# EAGLE board eightbyeight (EAGLE 7.7.0)
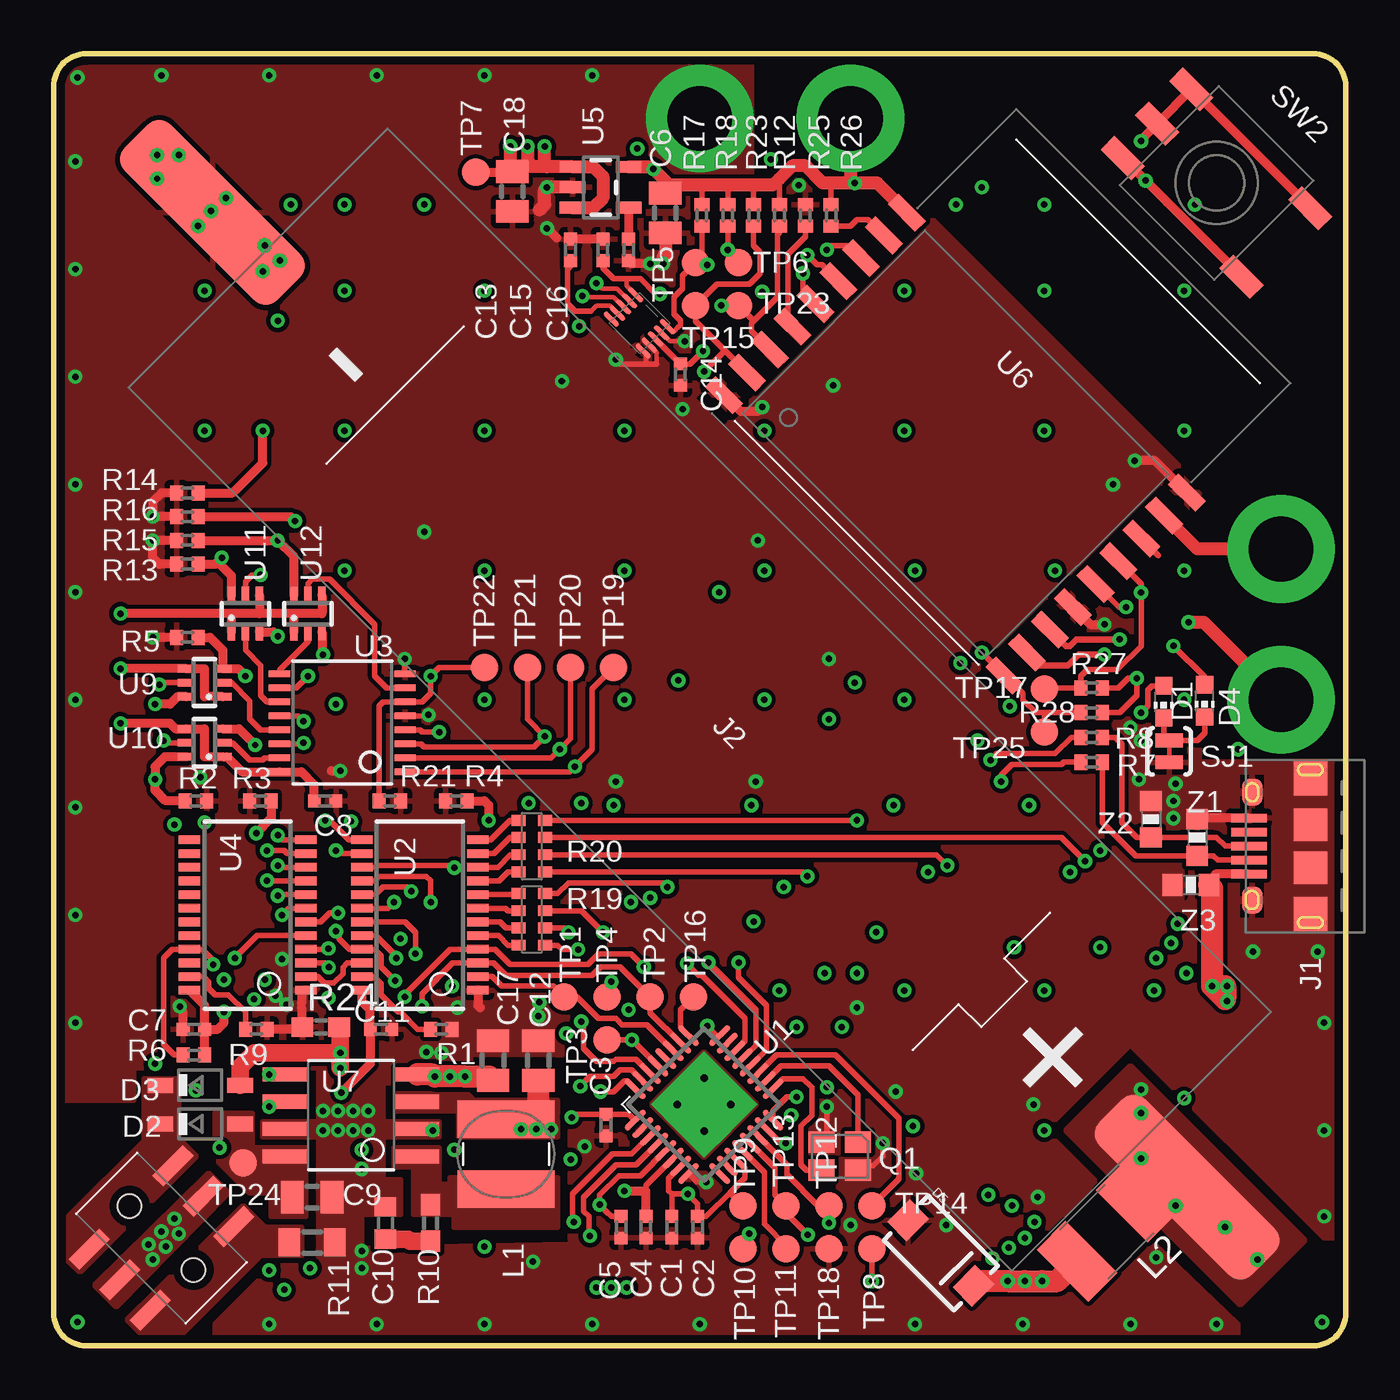
[diagram p6: board, top side]
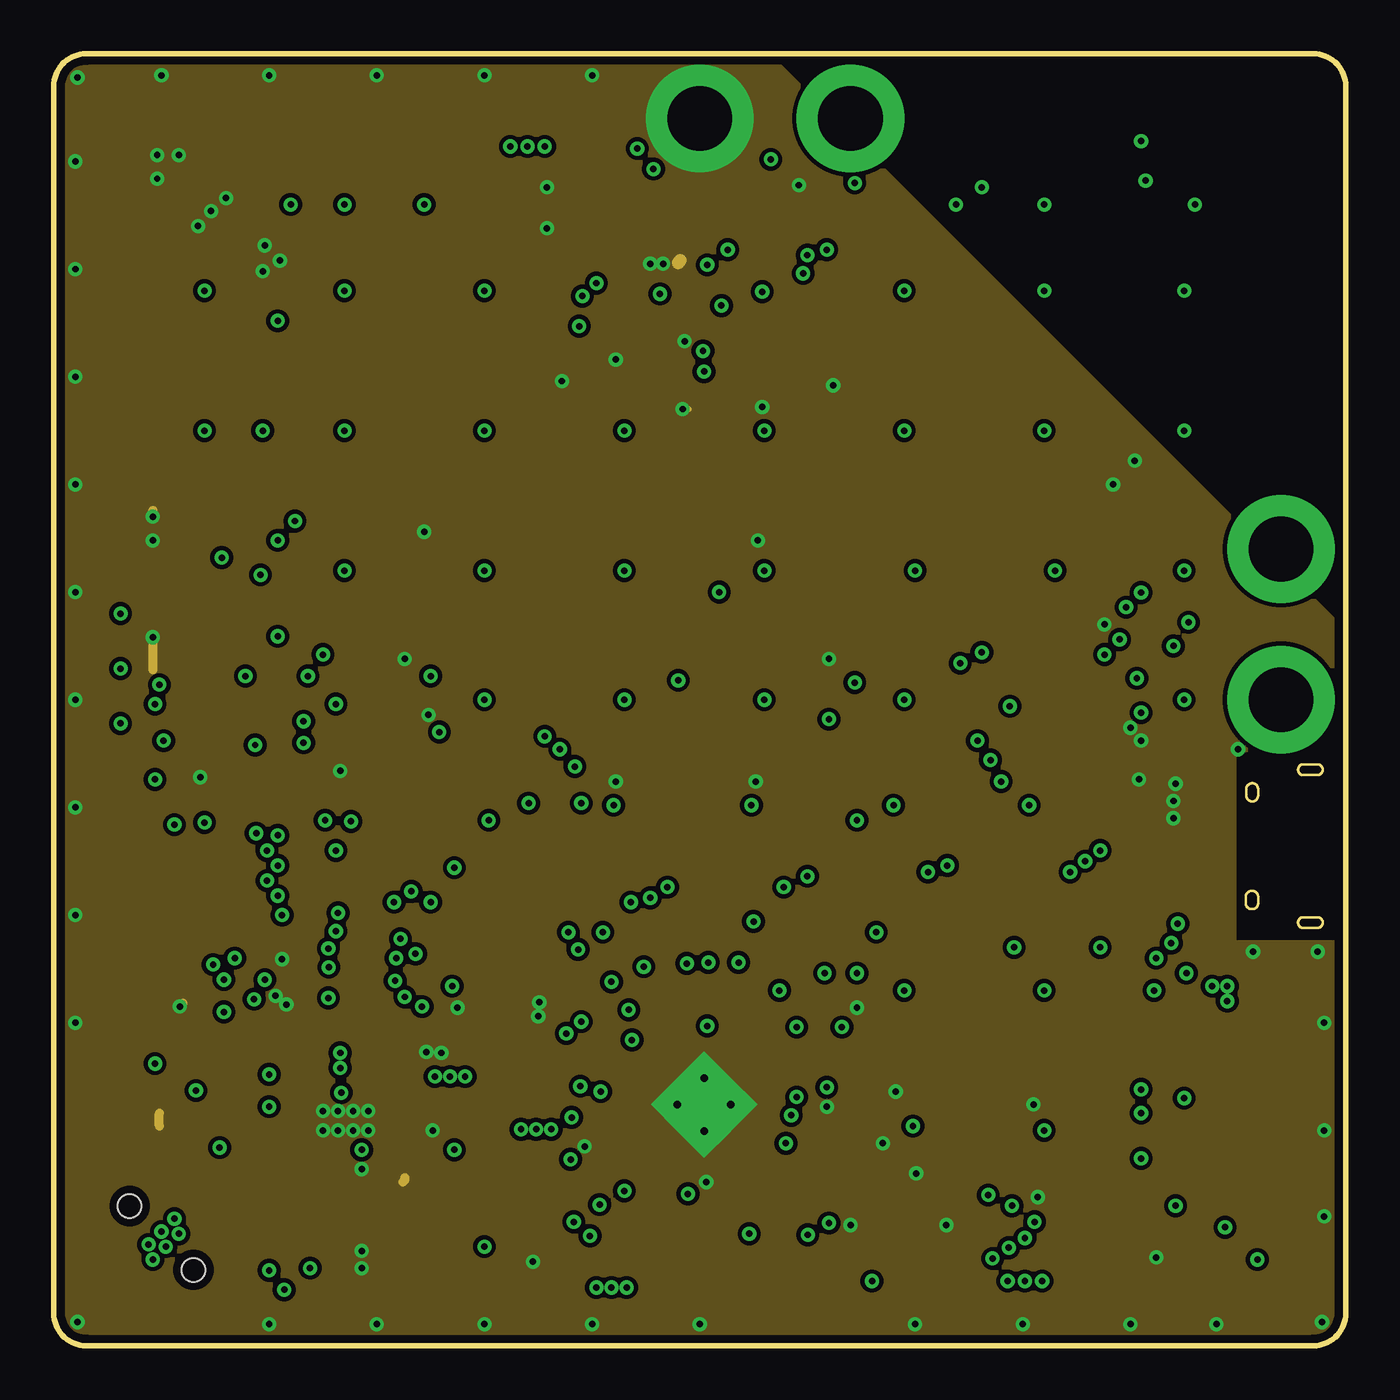
[diagram p7: board, inner layer GND]
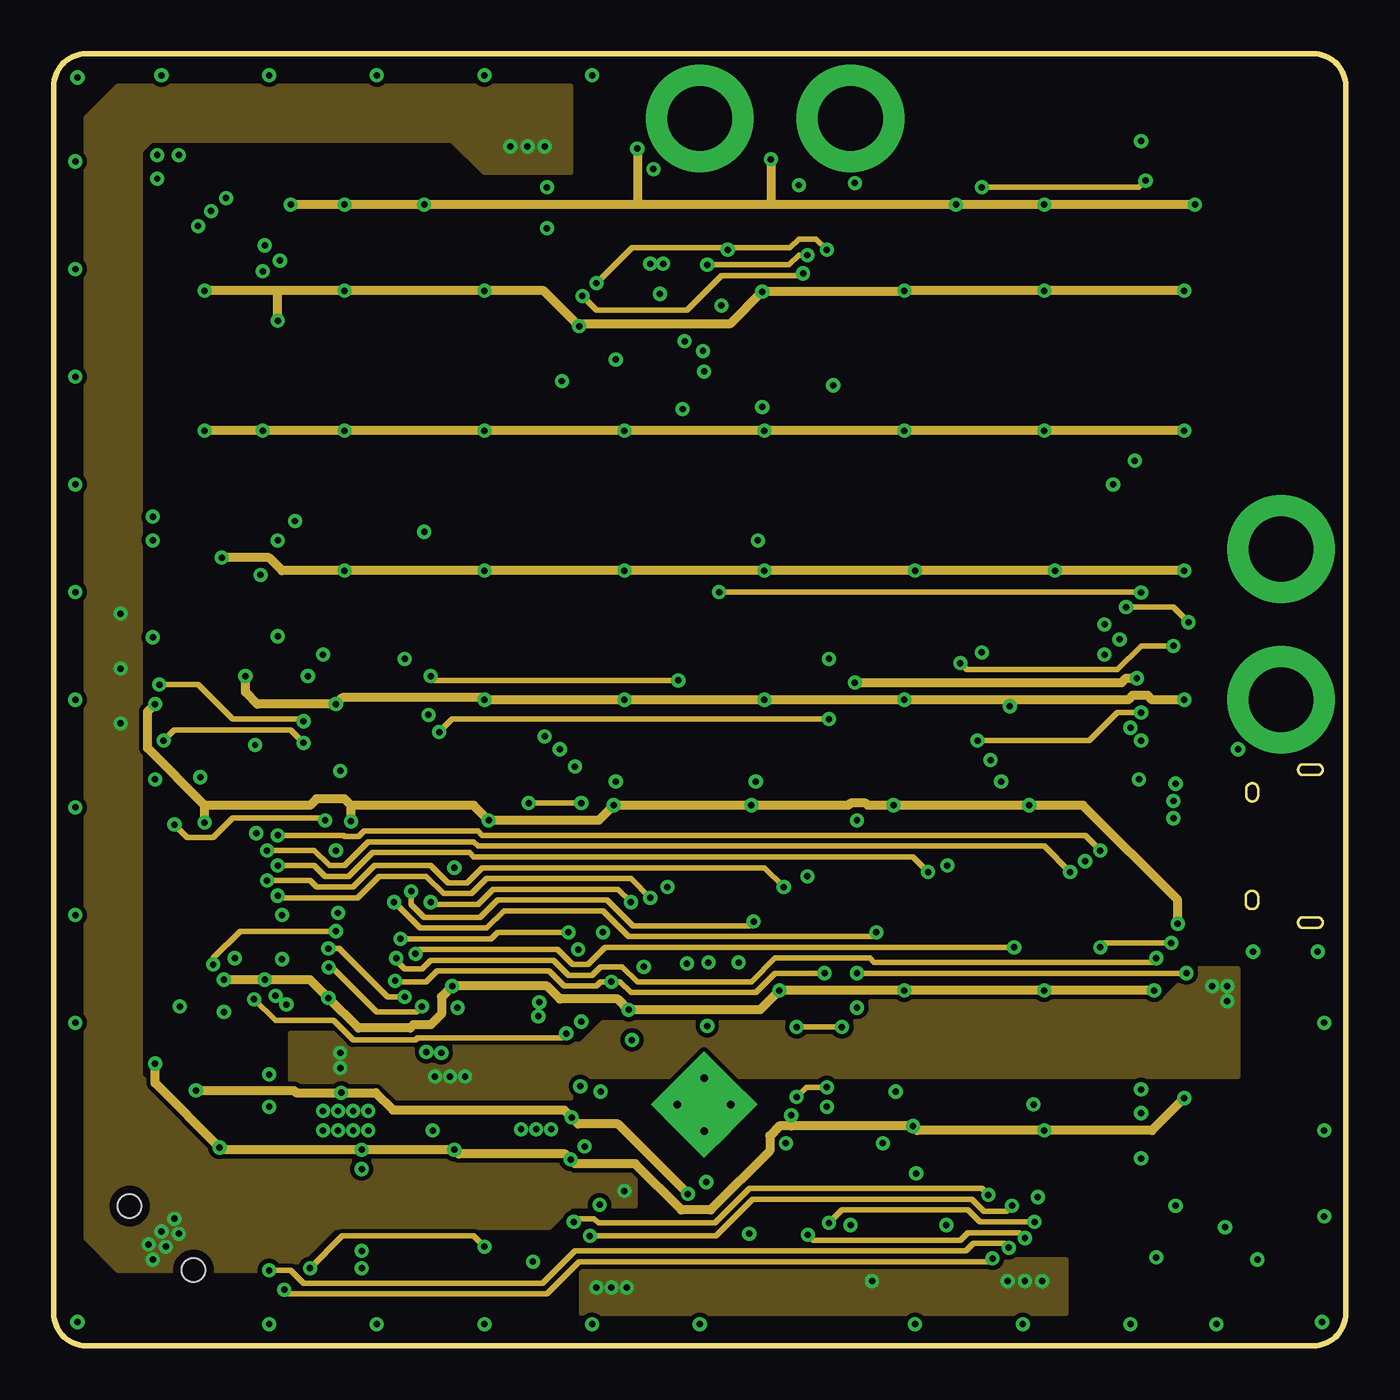
[diagram p8: board, inner layer Route]
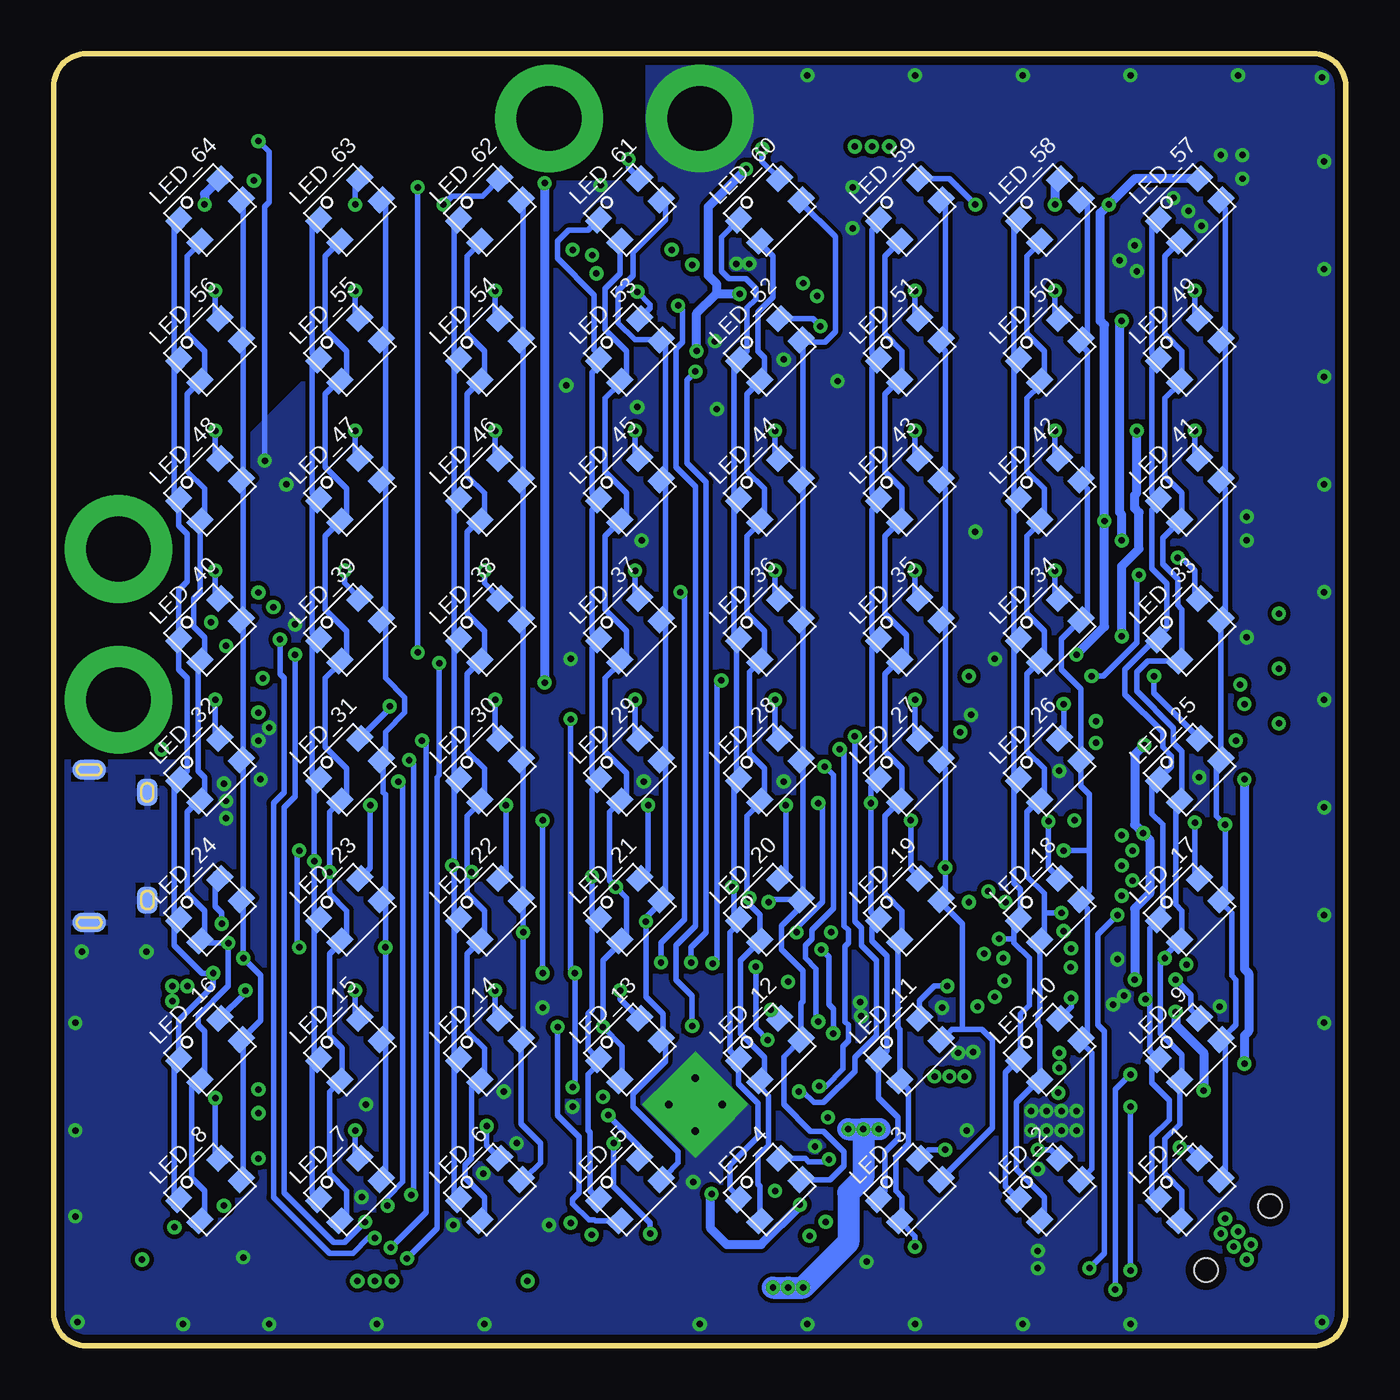
[diagram p9: board, bottom side, seen from below]

Size 60 x 60 mm. Coordinates in mm from the lower left corner, seen from the top.
Outline: 0,58.5 0,1.5 arc90 1.5,0 58.5,0 arc90 60,1.5 60,58.5 arc90 58.5,60 1.5,60 arc90 0,58.5
Copper layers (1*2+15*16): Top 0.0356mm / dielectric 0.6mm / GND 0.0356mm / dielectric 0.2mm / Route 0.0356mm / dielectric 0.6mm / Bottom 0.0356mm
Design rules "BlinkyTape *": minimum track width 0.25mm, minimum drill 0.3mm, track to track 0.2mm, track to pad 0.2mm, pad to pad 0.2mm, via to via 0.2mm, smd to smd 0.2mm, copper to edge 15mil, drill to drill 0.25mm, minimum pad ring 7mil, minimum via ring 7mil, stop-mask expansion 2mil, vias tented up to drill 0.35mm, thermal gap 10mil
Net classes: 1 power: width 0.254 mm, drill 0.35 mm
tRestrict: area 55.1,25.9 to 55.5,26.5; area 55.8,25.9 to 56.2,26.5; area 55.8,24.9 to 56.2,25.5; area 55.1,24.9 to 55.5,25.5; area 55.1,20.9 to 55.5,21.5; area 55.8,20.9 to 56.2,21.5; area 55.8,19.9 to 56.2,20.5; area 55.1,19.9 to 55.5,20.5; area 47.2,3.6 to 50.6,7; area 19.5,13.1 to 23.3,13.4; 13 lines
bRestrict: area 55.8,25.9 to 56.2,26.5; area 55.1,25.9 to 55.5,26.5; area 55.1,24.9 to 55.5,25.5; area 55.8,24.9 to 56.2,25.5; area 55.8,20.9 to 56.2,21.5; area 55.1,20.9 to 55.5,21.5; area 55.1,19.9 to 55.5,20.5; area 55.8,19.9 to 56.2,20.5; area 57.5,19.8 to 58.1,20.2; area 58.6,19.8 to 59.2,20.2; area 58.6,19.1 to 59.2,19.5; area 57.5,19.1 to 58.1,19.5; 4 more areas

## Footprints (pad centres in the part's own frame; a part is rotated, then mirrored left to right if it is on the bottom)
CAP_0402 = smd 0.6 x 0.6: 1 -0.5,0; 2 0.5,0
CAP_0805 = smd 1.05 x 1.5: 1 -0.925,0; 2 0.925,0
CAP_0603 = smd 0.9 x 1: 1 -0.75,0; 2 0.75,0
CHIP-LED0603 = smd 0.8 x 0.8: A 0,-0.75; C 0,0.75
SOD-123 = smd 1.2 x 0.7: A 1.85,0; C -1.85,0
SMA-DIODE = smd 1.27 x 1.47: A -2.15,0; C 2.15,0
USB_MICRO_THRUHOLE = smd 1.645 x 1.55: PAD$1 -3.172,0; PAD$4 3.172,0 | smd 1.5 x 1.55: PAD$2 -1,0; PAD$3 1,0 | smd 1.25 x 0.95: PAD$5 -2.5,2.7; PAD$6 2.5,2.7 | smd 0.9 x 1.55 bottom: PAD$7 -3.55,0; PAD$8 3.55,0 | smd 1.25 x 0.95 bottom: PAD$9 -2.5,2.7; PAD$10 2.5,2.7 | smd 0.4 x 1.65: PIN$1 -1.3,2.85; PIN$2 -0.65,2.85; PIN$3 0,2.85; PIN$4 0.65,2.85; PIN$5 1.3,2.85
BATTERY_AA_SMD = smd 10 x 3: + 32,0; - -32,0
INDUCTOR_CD43 = smd 1.75 x 4.5: P$1 -1.625,0; P$2 1.625,0
L1812 = smd 1.9 x 3.4: 1 -1.95,0; 2 1.95,0
LED_3528 = smd 1 x 0.8: 1 -1.35,0.7; 2 1.35,0.7; 3 1.36,-0.7; 4 -1.35,-0.7
CRSYTAL_2520 = smd 1.2 x 1: P$1 -0.85,-0.65; P$2 0.85,-0.65; P$3 0.85,0.65; P$4 -0.85,0.65
R_0402 = smd 0.6 x 0.7: 1 -0.5,0; 2 0.5,0
R_0603 = smd 1 x 0.9: 1 -0.85,0; 2 0.85,0
R_0805 = smd 1 x 1.3: 1 -1.05,0; 2 1.05,0
0603-ARV = smd 0.5 x 0.65: 1 -1.2,-0.625; 2 -0.4,-0.625; 3 0.4,-0.625; 4 1.2,-0.625; 5 1.2,0.625; 6 0.4,0.625; 7 -0.4,0.625; 8 -1.2,0.625
SJ_2S-TRACE = smd 0.635 x 1.27: 1 -0.508,0; 2 0.508,0
SWITCH_6P-2POS = smd 0.7 x 2: O0 -2,2.75; O1 -2,-2.75; P0 0,2.75; P1 0,-2.75; S0 2,2.75; S1 2,-2.75 | hole 1.1: -2.1,0; 2.1,0
TD-07XB = smd 2 x 0.9: 1 -3.9,-2.25; 2 3.9,-2.25; 3 -3.9,2.25; 4 3.9,2.25; 5 -3.9,0
B1,27 = smd 1.27 x 1.27: TP 0,0
QFN32_5X5_LONGLEADS = smd 1.25 x 0.275: 1 -2.775,1.75; 2 -2.775,1.25; 3 -2.775,0.75; 4 -2.775,0.25; 5 -2.775,-0.25; 6 -2.775,-0.75; 7 -2.775,-1.25; 8 -2.775,-1.75; 17 2.775,-1.75; 18 2.775,-1.25; 19 2.775,-0.75; 20 2.775,-0.25; 21 2.775,0.25; 22 2.775,0.75; 23 2.775,1.25; 24 2.775,1.75 | smd 0.275 x 1.25: 9 -1.75,-2.775; 10 -1.25,-2.775; 11 -0.75,-2.775; 12 -0.25,-2.775; 13 0.25,-2.775; 14 0.75,-2.775; 15 1.25,-2.775; 16 1.75,-2.775; 25 1.75,2.775; 26 1.25,2.775; 27 0.75,2.775; 28 0.25,2.775; 29 -0.25,2.775; 30 -0.75,2.775; 31 -1.25,2.775; 32 -1.75,2.775 | drill 0.35 pad 1.75 square: PAD@1 -0.875,0.875; PAD@4 0.875,0.875; PAD@11 0.875,-0.875 | drill 0.35 pad 1.76 square: PAD@9 -0.875,-0.875
SSOP24-150 = smd 1 x 0.4: 1 -2.7,3.493; 2 -2.7,2.857; 3 -2.7,2.223; 4 -2.7,1.587; 5 -2.7,0.953; 6 -2.7,0.318; 7 -2.7,-0.318; 8 -2.7,-0.953; 9 -2.7,-1.587; 10 -2.7,-2.223; 11 -2.7,-2.857; 12 -2.7,-3.493; 13 2.7,-3.493; 14 2.7,-2.857; 15 2.7,-2.223; 16 2.7,-1.587; 17 2.7,-0.953; 18 2.7,-0.318; 19 2.7,0.318; 20 2.7,0.953; 21 2.7,1.587; 22 2.7,2.223; 23 2.7,2.857; 24 2.7,3.493
TSSOP16 = smd 0.305 x 0.991: 1 -1.95,-2.918; 2 -1.3,-2.918; 3 -0.65,-2.918; 4 0,-2.918; 5 0.65,-2.918; 6 1.3,-2.918; 7 1.95,-2.918; 8 2.6,-2.918; 9 2.6,2.918; 10 1.95,2.918; 11 1.3,2.918; 12 0.65,2.918; 13 0,2.918; 14 -0.65,2.918; 15 -1.3,2.918; 16 -1.95,2.918
SOT23-5 = smd 0.55 x 1.2: 1 -0.95,-1.3; 2 0,-1.3; 3 0.95,-1.3; 4 0.95,1.3; 5 -0.95,1.3
ESP_WROOM_02 = smd 1.8 x 0.7: 3V3 -9.2,3; EN -9.2,1.5; GND$1 -9.2,-9; GND$2 9.2,3; GND$3 9.2,-4.5; IO0 -9.2,-7.5; IO2 -9.2,-6; IO4 9.2,-9; IO5 9.2,-3; IO12 -9.2,-1.5; IO13 -9.2,-3; IO14 -9.2,0; IO15 -9.2,-4.5; IO18 9.2,1.5; RST 9.2,-1.5; RXD 9.2,-7.5; TOUT 9.2,0; TXD 9.2,-6
SO08-150 = smd 0.66 x 2.032: 1 -1.905,-3.073; 2 -0.635,-3.073; 3 0.635,-3.073; 4 1.905,-3.073; 5 1.905,3.073; 6 0.635,3.073; 7 -0.635,3.073; 8 -1.905,3.073
VFDFN-10 = smd 0.9 x 0.225: P$1 -1.05,0.8; P$2 -1.05,0.4; P$3 -1.05,0; P$4 -1.05,-0.4; P$5 -1.05,-0.8; P$6 1.05,-0.8; P$7 1.05,-0.4; P$8 1.05,0; P$9 1.05,0.4; P$10 1.05,0.8
SC70-6L = smd 0.35 x 0.8: 1 -0.65,-0.85; 2 0,-0.85; 3 0.65,-0.85; 4 0.65,0.85; 5 0,0.85; 6 -0.65,0.85
IO_HOLE_3MM = drill 3 pad 5: 1 0,0
SPARKFUN-RESISTORS_0603-RES = smd 0.94 x 1.016: 1 -0.85,0; 2 0.85,0

## Placement (x,y rotation side)
C1  100nF  [CAP_0402]  28.7,5.5 270 top
C2  100nF  [CAP_0402]  29.9,5.5 270 top
C3  100nF  [CAP_0402]  25.65,10.25 270 top
C4  100nF  [CAP_0402]  27.5,5.5 270 top
C5  2.2uF  [CAP_0402]  26.35,5.5 270 top
C6  10uF  [CAP_0805]  28.4,52.6 270 top
C7  100nF  [CAP_0402]  6.5,14.7 180 top
C8  100nF  [CAP_0402]  12.6,25.3 0 top
C9  10uF  [CAP_0805]  12,6.9 0 top
C10  2.2nF  [CAP_0603]  15.4,5.7 90 top
C11  100nF  [CAP_0402]  15.2,14.7 0 top
C12  10uF  [CAP_0805]  22.5,13.25 90 top
C13  100nF  [CAP_0402]  24,50.9 90 top
C14  100nF  [CAP_0402]  29.1,45.1 270 top
C15  100nF  [CAP_0402]  25.5,50.9 90 top
C16  47pF  [CAP_0402]  26.7,50.9 270 top
C17  10uF  [CAP_0805]  20.4,13.25 90 top
C18  10uF  [CAP_0805]  21.3,53.6 270 top
D1  ORANGE  [CHIP-LED0603]  51.55,29.9 180 top
D2  1N5819  [SOD-123]  6.8,10.3 0 top
D3  1N5819  [SOD-123]  6.8,12.1 0 top
D4  PURPLE  [CHIP-LED0603]  53.45,29.95 180 top
D5  1N5822  [SMA-DIODE]  41.2,4.3 315 top
J1  USB_MICROSMT+THRUHULE  [USB_MICRO_THRUHOLE]  58.36,23.2 90 top
J2  BATTERYAA_SMD  [BATTERY_AA_SMD]  30,30 315 top
L1  2.2uH  [INDUCTOR_CD43]  21,8.9 270 top
L2  1812L260THDR  [L1812]  48.9,5.3 225 top
LED_1  LED_RGB_CA3528  [LED_3528]  7.25,7.25 45 bottom
LED_2  LED_RGB_CA3528  [LED_3528]  13.75,7.25 45 bottom
LED_3  LED_RGB_CA3528  [LED_3528]  20.25,7.25 45 bottom
LED_4  LED_RGB_CA3528  [LED_3528]  26.75,7.25 45 bottom
LED_5  LED_RGB_CA3528  [LED_3528]  33.25,7.25 45 bottom
LED_6  LED_RGB_CA3528  [LED_3528]  39.75,7.25 45 bottom
LED_7  LED_RGB_CA3528  [LED_3528]  46.25,7.25 45 bottom
LED_8  LED_RGB_CA3528  [LED_3528]  52.75,7.25 45 bottom
LED_9  LED_RGB_CA3528  [LED_3528]  7.25,13.75 45 bottom
LED_10  LED_RGB_CA3528  [LED_3528]  13.75,13.75 45 bottom
LED_11  LED_RGB_CA3528  [LED_3528]  20.25,13.75 45 bottom
LED_12  LED_RGB_CA3528  [LED_3528]  26.75,13.75 45 bottom
LED_13  LED_RGB_CA3528  [LED_3528]  33.25,13.75 45 bottom
LED_14  LED_RGB_CA3528  [LED_3528]  39.75,13.75 45 bottom
LED_15  LED_RGB_CA3528  [LED_3528]  46.25,13.75 45 bottom
LED_16  LED_RGB_CA3528  [LED_3528]  52.75,13.75 45 bottom
LED_17  LED_RGB_CA3528  [LED_3528]  7.25,20.25 45 bottom
LED_18  LED_RGB_CA3528  [LED_3528]  13.75,20.25 45 bottom
LED_19  LED_RGB_CA3528  [LED_3528]  20.25,20.25 45 bottom
LED_20  LED_RGB_CA3528  [LED_3528]  26.75,20.25 45 bottom
LED_21  LED_RGB_CA3528  [LED_3528]  33.25,20.25 45 bottom
LED_22  LED_RGB_CA3528  [LED_3528]  39.75,20.25 45 bottom
LED_23  LED_RGB_CA3528  [LED_3528]  46.25,20.25 45 bottom
LED_24  LED_RGB_CA3528  [LED_3528]  52.75,20.25 45 bottom
LED_25  LED_RGB_CA3528  [LED_3528]  7.25,26.75 45 bottom
LED_26  LED_RGB_CA3528  [LED_3528]  13.75,26.75 45 bottom
LED_27  LED_RGB_CA3528  [LED_3528]  20.25,26.75 45 bottom
LED_28  LED_RGB_CA3528  [LED_3528]  26.75,26.75 45 bottom
LED_29  LED_RGB_CA3528  [LED_3528]  33.25,26.75 45 bottom
LED_30  LED_RGB_CA3528  [LED_3528]  39.75,26.75 45 bottom
LED_31  LED_RGB_CA3528  [LED_3528]  46.25,26.75 45 bottom
LED_32  LED_RGB_CA3528  [LED_3528]  52.75,26.75 45 bottom
LED_33  LED_RGB_CA3528  [LED_3528]  7.25,33.25 45 bottom
LED_34  LED_RGB_CA3528  [LED_3528]  13.75,33.25 45 bottom
LED_35  LED_RGB_CA3528  [LED_3528]  20.25,33.25 45 bottom
LED_36  LED_RGB_CA3528  [LED_3528]  26.75,33.25 45 bottom
LED_37  LED_RGB_CA3528  [LED_3528]  33.25,33.25 45 bottom
LED_38  LED_RGB_CA3528  [LED_3528]  39.75,33.25 45 bottom
LED_39  LED_RGB_CA3528  [LED_3528]  46.25,33.25 45 bottom
LED_40  LED_RGB_CA3528  [LED_3528]  52.75,33.25 45 bottom
LED_41  LED_RGB_CA3528  [LED_3528]  7.25,39.75 45 bottom
LED_42  LED_RGB_CA3528  [LED_3528]  13.75,39.75 45 bottom
LED_43  LED_RGB_CA3528  [LED_3528]  20.25,39.75 45 bottom
LED_44  LED_RGB_CA3528  [LED_3528]  26.75,39.75 45 bottom
LED_45  LED_RGB_CA3528  [LED_3528]  33.25,39.75 45 bottom
LED_46  LED_RGB_CA3528  [LED_3528]  39.75,39.75 45 bottom
LED_47  LED_RGB_CA3528  [LED_3528]  46.25,39.75 45 bottom
LED_48  LED_RGB_CA3528  [LED_3528]  52.75,39.75 45 bottom
LED_49  LED_RGB_CA3528  [LED_3528]  7.25,46.25 45 bottom
LED_50  LED_RGB_CA3528  [LED_3528]  13.75,46.25 45 bottom
LED_51  LED_RGB_CA3528  [LED_3528]  20.25,46.25 45 bottom
LED_52  LED_RGB_CA3528  [LED_3528]  26.75,46.25 45 bottom
LED_53  LED_RGB_CA3528  [LED_3528]  33.25,46.25 45 bottom
LED_54  LED_RGB_CA3528  [LED_3528]  39.75,46.25 45 bottom
LED_55  LED_RGB_CA3528  [LED_3528]  46.25,46.25 45 bottom
LED_56  LED_RGB_CA3528  [LED_3528]  52.75,46.25 45 bottom
LED_57  LED_RGB_CA3528  [LED_3528]  7.25,52.75 45 bottom
LED_58  LED_RGB_CA3528  [LED_3528]  13.75,52.75 45 bottom
LED_59  LED_RGB_CA3528  [LED_3528]  20.25,52.75 45 bottom
LED_60  LED_RGB_CA3528  [LED_3528]  26.75,52.75 45 bottom
LED_61  LED_RGB_CA3528  [LED_3528]  33.25,52.75 45 bottom
LED_62  LED_RGB_CA3528  [LED_3528]  39.75,52.75 45 bottom
LED_63  LED_RGB_CA3528  [LED_3528]  46.25,52.75 45 bottom
LED_64  LED_RGB_CA3528  [LED_3528]  52.75,52.75 45 bottom
Q1  16MHz  [CRSYTAL_2520]  36.5,8.8 180 top
R1  1k 1%  [R_0402]  18,14.7 180 top
R2  4.7k  [R_0402]  6.6,25.3 180 top
R3  4.7k  [R_0402]  9.6,25.3 0 top
R4  4.7k  [R_0402]  18.7,25.3 0 top
R5  4.7k  [R_0402]  6.2,32.9 0 top
R6  10k  [R_0402]  6.5,13.5 0 top
R7  33  [R_0402]  48.2,27.1 180 top
R8  33  [R_0402]  48.2,28.25 180 top
R9  1k 1%  [R_0402]  9.4,14.7 180 top
R10  1  [R_0603]  17.5,5.7 270 top
R11  47  [R_0805]  12,4.8 180 top
R12  10k  [R_0402]  33.7,52.5 90 top
R13  4.7k  [R_0402]  6.2,36.3 0 top
R14  4.7k  [R_0402]  6.2,39.6 0 top
R15  4.7k  [R_0402]  6.2,37.4 0 top
R16  4.7k  [R_0402]  6.2,38.5 0 top
R17  4.7k  [R_0402]  30.1,52.5 90 top
R18  4.7k  [R_0402]  31.3,52.5 90 top
R19  200  [0603-ARV]  22.2,19.8 270 top
R20  200  [0603-ARV]  22.2,23.2 270 top
R21  10k  [R_0402]  15.6,25.3 180 top
R23  10k  [R_0402]  32.5,52.5 90 top
R24  510  [R_0603]  12.4,14.8 0 top
R25  10k  [R_0402]  34.9,52.5 270 top
R26  10k  [R_0402]  36.1,52.5 90 top
R27  10k  [R_0402]  48.2,30.55 0 top
R28  10k  [R_0402]  48.2,29.4 0 top
SJ1  SOLDERJUMPERTRACE  [SJ_2S-TRACE]  51.8,27.6 90 top
SW1  SWITCH_SPDT  [SWITCH_6P-2POS]  5,5 135 top
SW2  BRIGHTNESS  [TD-07XB]  54,54 315 top
TP1  PTR1B1,27  [B1,27]  23.7,16.2 0 top
TP2  PTR1B1,27  [B1,27]  27.7,16.2 0 top
TP3  PTR1B1,27  [B1,27]  25.7,14.2 0 top
TP4  PTR1B1,27  [B1,27]  25.7,16.2 0 top
TP5  PTR1B1,27  [B1,27]  29.8,50.3 0 top
TP6  PTR1B1,27  [B1,27]  31.8,50.3 0 top
TP7  PTR1B1,27  [B1,27]  19.6,54.5 0 top
TP8  PTR1B1,27  [B1,27]  38,4.5 0 top
TP9  PTR1B1,27  [B1,27]  32,6.5 0 top
TP10  PTR1B1,27  [B1,27]  32,4.5 0 top
TP11  PTR1B1,27  [B1,27]  34,4.5 0 top
TP12  PTR1B1,27  [B1,27]  36,6.5 0 top
TP13  PTR1B1,27  [B1,27]  34,6.5 0 top
TP14  PTR1B1,27  [B1,27]  38,6.5 0 top
TP15  PTR1B1,27  [B1,27]  29.8,48.3 0 top
TP16  PTR1B1,27  [B1,27]  29.7,16.2 0 top
TP17  PTR1B1,27  [B1,27]  46,30.5 0 top
TP18  PTR1B1,27  [B1,27]  36,4.5 0 top
TP19  PTR1B1,27  [B1,27]  26,31.5 0 top
TP20  PTR1B1,27  [B1,27]  24,31.5 0 top
TP21  PTR1B1,27  [B1,27]  22,31.5 0 top
TP22  PTR1B1,27  [B1,27]  20,31.5 0 top
TP23  PTR1B1,27  [B1,27]  31.8,48.3 0 top
TP24  PTR1B1,27  [B1,27]  8.8,8.5 0 top
TP25  PTR1B1,27  [B1,27]  46,28.5 0 top
U1  MK20DN64VFM5  [QFN32_5X5_LONGLEADS]  30.2,11.2 45 top
U2  ICN2027SSOP24-150  [SSOP24-150]  17,20 180 top
U3  74138  [TSSOP16]  13.4,28.6 90 top
U4  ICN2027SSOP24-150  [SSOP24-150]  9,20 180 top
U5  MIC5219 3.3V  [SOT23-5]  25.4,53.8 270 top
U6  ESP_WROOM_02  [ESP_WROOM_02]  44,44 315 top
U7  MP3401A  [SO08-150]  13.8,10.7 90 top
U8  MMA8653FC  [VFDFN-10]  27.2,47.5 315 top
U9  FDG6316P  [SC70-6L]  7,30.8 90 top
U10  FDG6316P  [SC70-6L]  7,28 90 top
U11  FDG6316P  [SC70-6L]  8.9,34 0 top
U12  FDG6316P  [SC70-6L]  11.8,34 0 top
U$2  TEST_POINT  [IO_HOLE_3MM]  30,57 0 top
U$6  TEST_POINT  [IO_HOLE_3MM]  57,30 0 top
U$9  TEST_POINT  [IO_HOLE_3MM]  57,37 0 top
U$10  TEST_POINT  [IO_HOLE_3MM]  37,57 0 top
Z1  PGB1010603  [SPARKFUN-RESISTORS_0603-RES]  53.1,23.6 270 top
Z2  PGB1010603  [SPARKFUN-RESISTORS_0603-RES]  50.95,24.45 270 top
Z3  PGB1010603  [SPARKFUN-RESISTORS_0603-RES]  52.8,21.4 0 top

## Tracks (layer width: path | path; a pad name or v marks a point on that pad's centre or on a via)
1ROW0  (via drill 0.3)
  Top 0.406: U10.6 5.15,27.35 4.7,26.9 v4.7,26.3 4.7,25.8 5.2,25.3 R2.2
  Route 0.254: v34.25,10.7 34.25,10.2
  Route 0.406: v52.5,11.5 51,10 v46,10 40.1,10 v39.9,10.2 34.25,10.2 33.7,10.2 33.25,9.75 33.25,9.05 30.5,6.3 29.15,6.3 27,8.45 24.2,8.45 v24,8.65 23.75,8.9 18.8,8.9 v18.6,9.1 v14.3,9.1 7.8,9.1 v7.7,9.2 4.7,12.2 v4.7,13.1
  Bottom 0.254: LED_8.2 52.5,8.91 v52.5,11.5 | LED_7.2 46,8.91 v46,10 | LED_6.2 39.9,9.31 v39.9,10.2 | 26.5,8.49 LED_4.2 | LED_5.2 32.79,9.24 v34.25,10.7 | v24,8.65 24.1,8.55 24.95,8.55 25.1,8.7 25.3,8.7 | LED_4.2 | LED_1.2 7.29,9.2 v7.7,9.2 | LED_3.2 19.39,9.1 v18.6,9.1 | LED_2.2 13.69,9.1 v14.3,9.1 | 25.3,8.7 | 25.3,8.7 LED_4.2
  Bottom 0.406: v4.7,26.3 4.7,17.5 4.5,17.3 4.5,14.6 4.7,14.4 v4.7,13.1
1ROW1  (via drill 0.3)
  Top 0.406: U10.3 8.6,28.65 v9.35,27.9 | R3.2 10.1,24.5 v9.4,23.8
  Route 0.406: v51.1,16.5 v46,16.5 v39.5,16.5 v33.7,16.5 32.8,15.6 v26.7,15.6 | 26.6,15.6 v26.7,15.6 | v26.7,15.6 26.2,16.1 23.5,16.1 22.9,16.7 v18.5,16.7 18,16.2 18,15.4 17.5,14.9 16.7,14.9 16.55,14.75 14.15,14.75 v12.75,16.15 11.9,17 v9.8,17 v7.9,17
  Bottom 0.254: LED_15.2 46,15.41 v46,16.5 | LED_14.2 39.5,15.41 v39.5,16.5 | LED_13.2 33.7,16.11 v33.7,16.5 | v51.1,16.5 51.1,16.39 LED_16.2 | v7.9,17 7.2,16.3 7.2,15.61 LED_9.2 | LED_10.2 12.75,15.74 v12.75,16.15 | LED_12.2 v26.7,15.6 | LED_11.2 19.79,16.01 19.1,16.7 v18.5,16.7
  Bottom 0.406: v9.35,27.9 9.8,27.45 9.8,24.2 v9.4,23.8 9.1,23.5 9.1,21 9.8,20.3 v9.8,17
1ROW2  (via drill 0.3)
  Top 0.406: U9.6 5.75,30.15 5.4,29.8 v4.7,29.8 | R4.2 20,25.3 20.2,25.1 v20.2,24.4
  Route 0.406: v52.2,19.6 52.2,20.7 47.8,25.1 v45.3,25.1 v39,25.1 37.8,25.1 37.7,25.2 37,25.2 36.9,25.1 v32.4,25.1 v26,25.1 25.3,24.4 v20.2,24.4 19.5,25.1 13.8,25.1 | v13.8,24.35 13.8,25.1 | 13.8,25.1 13.5,25.4 12.2,25.4 11.9,25.1 7,25.1 | v7,24.3 7,25.1 | 7,25.1 4.35,27.75 4.35,29.45 v4.7,29.8
  Bottom 0.254: LED_24.2 52.5,21.91 52.5,20.4 52.2,20.1 v52.2,19.6 | v26,25.1 26,22.01 26.29,21.72 LED_20.2 | LED_19.2 20.2,22.11 v20.2,24.4 | LED_17.2 7,21.91 v7,24.3 | LED_18.2 13.8,22.21 v13.8,24.35 | LED_22.2 39,21.99 v39,25.1 | LED_21.2 32.4,22.09 v32.4,25.1 | LED_23.2 45.3,22.19 v45.3,25.1
1ROW3  (via drill 0.3)
  Top 0.406: v8.9,31.1 8.55,31.45 U9.3 7.85,32.3 7.25,32.9 R5.2
  Route 0.406: v52.5,30 51,30 50.8,30.2 50.1,30.2 49.9,30 44.4,30 | v44.4,29.7 44.4,30 | 44.4,30 v39.5,30 v33,30 v26.5,30 v20,30 19.9,30.1 13.4,30.1 v13.1,29.8 9.45,29.8 8.9,30.35 v8.9,31.1
  Bottom 0.254: LED_32.2 52.5,28.41 v52.5,30 | LED_30.2 39.5,28.41 v39.5,30 | LED_29.2 33,28.41 v33,30 | LED_28.2 26.5,28.41 v26.5,30 | LED_27.2 20,28.41 v20,30 | v13.1,29.8 13.1,28.39 LED_26.2 | LED_25.2 8.9,30.31 v8.9,31.1 | LED_31.2 44.4,29.59 v44.4,29.7
1ROW4  (via drill 0.3)
  Top 0.406: R13.2 7.5,36.3 v7.8,36.6 | U11.6 8.25,35.75 7.8,36.2 v7.8,36.6 | 7.55,36.35 v7.8,36.6
  Route 0.406: v52.5,36 v46.5,36 v40,36 v33,36 v26.5,36 v20,36 v13.5,36 10.6,36 10,36.6 v7.8,36.6
  Bottom 0.254: LED_40.2 52.5,34.91 v52.5,36 | LED_33.2 7,34.91 7,36 7.6,36.6 v7.8,36.6 | LED_34.2 13.5,34.91 v13.5,36 | LED_35.2 20,34.91 v20,36 | LED_36.2 26.5,34.91 v26.5,36 | LED_37.2 33,34.91 v33,36 | LED_38.2 40,35.41 v40,36 | LED_39.2 46.5,35.41 v46.5,36
1ROW5  (via drill 0.3)
  Top 0.406: U11.3 10.2,33.15 v10.4,32.95 | R14.2 8.3,39.6 9.7,41 v9.7,42.5
  Route 0.406: v52.5,42.5 v46,42.5 v39.5,42.5 v33,42.5 v26.5,42.5 v20,42.5 v13.5,42.5 v9.7,42.5 v7,42.5
  Bottom 0.254: LED_48.2 52.5,41.41 v52.5,42.5 | LED_41.2 7,41.41 v7,42.5 | LED_42.2 13.5,41.41 v13.5,42.5 | LED_43.2 20,41.41 v20,42.5 | LED_44.2 26.5,41.41 v26.5,42.5 | LED_45.2 33,41.41 v33,42.5 | LED_46.2 39.5,41.41 v39.5,42.5 | LED_47.2 46,41.41 v46,42.5
  Bottom 0.406: v10.4,32.95 10.4,36.2 9.6,37 9.6,38.7 9.8,38.9 9.8,39.5 9.7,39.6 v9.7,42.5
1ROW6  (via drill 0.3)
  Top 0.406: R15.2 v10.4,37.4 11.15,36.65 U12.6
  Route 0.406: v52.5,49 v46,49 v39.5,49 39.45,48.95 v32.9,48.95 31.4,47.45 24.5,47.45 v24.4,47.35 22.75,49 v20,49 v13.5,49 10.4,49 | 10.4,49 v7,49 | v10.4,47.6 10.4,49
  Bottom 0.254: LED_56.2 52.5,47.91 v52.5,49 | LED_55.2 46,47.91 v46,49 | LED_54.2 39.5,47.91 v39.5,49 | 32.74,47.76 32.75,47.76 32.79,47.72 LED_53.2 32.3,48.19 32.3,48.35 v32.9,48.95 | LED_51.2 20,47.91 v20,49 | LED_50.2 13.5,47.91 v13.5,49 | LED_49.2 7,47.91 v7,49 | v24.4,47.35 24.75,47.7 LED_52.2
  Bottom 0.406: v10.4,37.4 10.4,38.6 10.5,38.7 10.5,47.5 v10.4,47.6
1ROW7  (via drill 0.3)
  Top 0.406: R16.2 11,38.5 v11.2,38.3 | U12.3 12.45,32.15 v12.5,32.1
  Route 0.406: v53,53 v46,53 v41.9,53 33.3,53 | 33.3,53 27.1,53 | v27.1,55.6 27.1,53 | 27.1,53 v17.2,53 v13.5,53 v11,53 | v33.3,55.1 33.3,53
  Bottom 0.254: LED_63.2 46,53.99 v46,53 | LED_59.2 18.4,54.2 v17.2,53 | v41.9,53 41.5,53.4 40.09,53.4 LED_62.2 | LED_60.2 27.1,54.99 v27.1,55.6 | LED_61.2 33.3,54.71 v33.3,55.1
  Bottom 0.406: LED_64.2 53,53.49 v53,53 | LED_60.2 | LED_58.2 13.5,53.99 v13.5,53 | v12.5,32.1 11.2,33.4 v11.2,38.3 11.2,47.4 11.4,47.6 11.4,52.6 v11,53 9.8,54.2 LED_57.2
+3V3  (via drill 0.3)
  Top 0.203: U8.P$1 26.6,49.23 26.6,49.55
  Top 0.254: C15.1 25.5,50.05 26,49.55 26.6,49.55 27.25,49.55 27.95,48.85 v28.15,48.85 | R27.2 49.45,30.55 49.9,31 v50.3,31 50.3,30.2 49.5,29.4 R28.2 | R26.2 36.1,54 | R12.2 33.7,54.2 | R23.2 32.5,53.9 | R18.2 31.3,53.9 | R17.2 30.1,53.9 | v30.15,46.2 29.55,45.6 C14.1 U8.P$8 | U8.P$8
  Top 0.406: 37,54.2 v37.2,54
  Top 0.61: U6.3V3 38.24,54 v37.2,54 36.1,54 35.7,54 34.9,54.8 34.3,54.8 33.7,54.2 33.4,53.9 32.5,53.9 31.3,53.9 30.1,53.9 28.6,53.9 | 28.6,53.9 28.4,53.9 C6.1 | U5.5 27.75,54.75 v27.85,54.65 28.6,53.9 | U$10.1 37,54.2
  Route 0.406: v37.2,30.8 49.6,30.8 49.8,31 v50.3,31
  Bottom 0.406: v30.15,46.2 30.15,47.95 29.25,48.85 29.2,48.85 | 29.2,48.85 29.2,49.3 29.6,49.7 29.6,52.9 v27.85,54.65 | v28.15,48.85 29.2,48.85 | v37.2,54 v37.2,30.8
+5V  (via drill 0.3)
  Top 0.254: U1.6 27.5,7.44 27.5,7.19
  Top 0.406: U11.4 9.55,34 | U11.1 8.25,34 | U12.1 11.15,34 | 11.15,34 9.55,34 | U12.4 12.45,34 11.15,34 | 9.55,34 8.25,34 | U9.1 7,30.15 7,31.45 U9.4 v3.1,31.45 | v3.1,28.9 5.4,28.9 5.65,28.65 U10.4 7,28.65 7,27.35 U10.1 8.05,27.35 8.75,26.65 U3.16 11.5,26.65 12.1,26.05 C8.1 | 8.25,34 v3.1,34 | C4.1 27.5,7.19 v26.5,7.19 | TP7.TP 21.27,54.5 C18.1
  Top 0.61: 22.9,54.75 U5.1 25.05,54.75 25.5,54.3 25.5,53.3 25.05,52.85 U5.3 | 22.9,54.75 21.6,54.75 | 22.9,54.75 22.8,54.85 v22.8,55.7 | v22,55.7 22,55 22.1,54.9 22,54.8 21.2,54.8 | v21.2,55.7 21.2,54.8 | 21.2,54.8 21.2,54.62 C18.1
  other vias: 4.6,4 5.6,5.9 4.4,4.7 5.2,4.6 5.8,5.2 5,5.3
  pour Top (no thermals): 7.2,8 8.1,7.1 2.9,1.8 1.9,2.8
  pour Route: 24,54.5 24,58.5 3,58.5 1.5,57 1.5,5 3,3.5 11,3.5 13,5.5 23,5.5 24,6.5 27,6.5 27,9 7.5,9 4,12.5 4,55.5 4.5,56 18.5,56 20,54.5
+5V_BLEED
  pour Top (no thermals): 11.5,4.2 11.5,5.5 9.8,5.5 8.8,6.5 3.4,1.2 4,0.6 6,0.6 9.6,4.2
+5V_SWITCH
  pour Top (no thermals): 1.2,3.4 6.6,8.8 5.8,9.6 5.8,12.4 4.2,12.4 4.2,9.5 0.7,6 0.7,3.9
ACC_INT1  (via drill 0.3)
  Top 0.203: U8.P$3 26,48.7 24.6,48.7 v24.55,48.75
  Top 0.254: U6.IO13 34.8,48.96 v34.8,49.8
  Route 0.254: v24.55,48.75 25.2,48.1 29.4,48.1 31,49.7 34.7,49.7 v34.8,49.8
ARM_3V3  (via drill 0.3)
  Top 0.254: U1.11 32.1,8.24 32.1,7.8 31.4,7.1 | 31.4,7.1 30.3,6 C2.1 29.9,6.6 v29.45,7.05 28.7,7.05 | 28.7,7.05 28.55,7.2 28.55,7.78 U1.7 | 25.75,6.15 v25.35,6.55 | C1.1 28.7,7.05 | v25.35,6.55 25.35,7 26.25,7.9 27.25,7.9 U1.5 | TP9.TP 31.4,7.1 | U1.1 26.73,10.75 C3.1 24.2,10.75 v24.05,10.6 | C5.1 25.9,6 v25.35,6.55
  Top 0.406: R6.2 C7.1 | U2.24 14.3,16 14.7,15.6 C11.1 14.7,13.1 v13.35,11.75 | C7.1 7.6,14.7 7.9,15 v7.9,15.5 | C7.1 7,15.81 U4.24
  Route 0.406: v29.45,7.05 26.2,10.3 24.35,10.3 v24.05,10.6 23.7,10.95 15.75,10.95 14.95,11.75 v13.35,11.75 11.25,11.75 11.15,11.85 v6.6,11.85
  Bottom 0.406: v25.35,6.55 25.35,6.5 27.15,4.7 28.75,4.7 29.5,5.45 29.5,7 v29.45,7.05 | v7.9,15.5 7.9,14.9 6.6,13.6 v6.6,11.85
ARM_BOOTLOADER
  Top 0.254: U1.25 29.1,14.78 29.1,15.6 TP16.TP
ARM_RESET
  Top 0.254: U1.19 33.56,13.5 36.3,13.5 39.24,10.56 39.24,7.74 TP14.TP
ARM_RX  (via drill 0.3)
  Top 0.254: U1.13 33.5,8.25 33.5,7 TP13.TP 34,6.17 v35.02,5.15
  Top 0.305: U6.TXD 47.02,32.5 47.2,32.5 47.5,32.8 v49.5,32.8
  Route 0.254: v35.02,5.15 35.27,4.9 42.1,4.9 42.45,5.25 44.85,5.25 v45.1,5
  Bottom 0.254: v49.5,32.8 49.5,31.2 49.3,31 49.3,25.7 49.8,25.2 49.8,6.9 47.2,4.3 46.1,4.3 45.4,5 v45.1,5
ARM_RX1  (via drill 0.3)
  Top 0.254: R12.1 33.7,51.7 33.6,51.6 33.6,48.7 32.45,47.55 | U1.24 30.8,14.4 v30.35,14.85 | v31.01,48.31 TP23.TP 32.45,47.65 32.45,47.55 | U6.IO2 32.4,47.12 32.4,47.5 32.45,47.55
  Bottom 0.254: v30.35,14.85 30.35,16.25 31.1,17 31.1,18.6 30.2,19.5 30.2,39.9 31.1,40.8 31.1,46.3 30.8,46.6 30.8,48.1 v31.01,48.31
ARM_TCK
  Top 0.254: U1.12 33,8.05 33,5.65 34,4.65 TP11.TP
ARM_TMS  (via drill 0.3)
  Top 0.254: U1.15 33.77,9.4 v34,9.4 | TP10.TP 32,4.9 v32.3,5.2
  Bottom 0.254: v34,9.4 34,7.4 32.3,5.7 v32.3,5.2
ARM_TX  (via drill 0.3)
  Top 0.254: U1.14 34.05,8.41 34.05,7.95 35.5,6.5 TP12.TP v36,5.7
  Top 0.305: U6.RXD 45.79,31.6 47.1,31.6 47.6,32.1 v48.8,32.1
  Route 0.254: v36,5.7 36.6,6.3 42.45,6.3 43,5.75 v45.55,5.75
  Bottom 0.254: v48.8,32.1 48.8,25.5 49.3,25 49.3,7.1 47,4.8 46.5,4.8 v45.55,5.75
BCOL0  (via drill 0.3)
  Top 0.254: U2.13 13.71,23.49 12.8,24.4 v12.6,24.4
  Route 0.254: v12.6,24.4 12.5,24.5 8.3,24.5 7.4,23.6 6.2,23.6 v5.6,24.2
  Bottom 0.254: LED_57.3 5.79,52.99 5.6,52.8 5.6,46.91 LED_49.3 5.72,46.72 5.6,46.6 5.6,40.41 LED_41.3 5.79,39.99 5.6,39.8 5.6,33.91 LED_33.3 LED_25.3 5.79,27.19 5.8,27.2 6,27 6,24.6 v5.6,24.2 5.6,20.91 LED_17.3 5.79,20.59 5.3,20.1 5.3,17.2 5.1,17 5.1,14.9 5.29,14.71 5.3,14.71 LED_9.3 5.79,14.19 5.6,14 5.6,7.91 LED_1.3
BCOL1  (via drill 0.3)
  Top 0.254: v13.1,23 13.24,22.86 U2.14
  Bottom 0.254: LED_58.3 12.29,53.09 12.2,53 12,53 12,47.01 LED_50.3 12.29,46.49 12,46.2 12,40.51 LED_42.3 12.29,40.09 12,39.8 12,34.01 LED_34.3 13.2,32.81 13.2,31.4 12.29,30.49 LED_26.3 12.29,25.99 11.9,25.6 11.9,23 | 12.2,14.31 LED_10.3 12.29,14.21 | 12.29,14.21 12.29,14.09 11.8,13.6 11.8,8.21 LED_2.3 | v13.1,23 11.9,23 | 11.9,23 11.9,21.11 LED_18.3 12.29,20.59 12,20.3 12,14.5 12.29,14.21
BCOL2  (via drill 0.3)
  Top 0.254: U2.15 14.92,22.22 15,22.3 18.5,22.3 v18.6,22.2
  Bottom 0.254: LED_59.3 18.79,53.19 18.6,53 18.6,46.91 LED_51.3 18.79,46.39 18.6,46.2 18.6,40.41 LED_43.3 18.79,39.99 18.6,39.8 18.6,33.91 LED_35.3 18.79,33.59 18.6,33.4 18.6,27.41 LED_27.3 18.79,26.99 18.6,26.8 v18.6,22.2 18.6,20.91 LED_19.3 18.79,20.59 17.8,19.6 17.8,14.7 | 18.69,14.31 18.7,14.31 LED_11.3 18.3,14.7 17.8,14.7 | 17.8,14.7 16.9,14.7 16.4,14.2 16.4,10.11 LED_3.3
BCOL3  (via drill 0.3)
  Top 0.254: U2.16 14.89,21.59 15.1,21.8 17.3,21.8 17.5,21.6 v17.5,20.6
  Route 0.254: v17.5,20.6 17.6,20.5 19.7,20.5 20.4,21.2 26.2,21.2 v26.8,20.6
  Bottom 0.254: LED_60.3 25.29,53.09 23.7,51.5 23.7,47.1 24.18,46.62 25.19,46.62 LED_52.3 25.29,46.69 25.2,46.6 25.2,40.31 LED_44.3 25.29,40.09 25.2,40 25.2,33.81 LED_36.3 25.29,33.49 25.2,33.4 25.2,27.31 LED_28.3 25.29,27.09 25.2,27 25.2,20.81 LED_20.3 | LED_20.3 25.29,20.41 26.2,19.5 26.2,18.4 25.2,17.4 25.2,16 25.29,15.91 LED_12.3 26.1,13.41 26.1,11.2 24.85,9.95 24.25,9.95 23.3,9 23.3,8.35 23.95,7.7 25.28,7.7 LED_4.3 | LED_20.3 26.68,20.72 v26.8,20.6
BCOL4  (via drill 0.3)
  Top 0.254: U2.17 14.95,20.95 15.3,21.3 16.4,21.3 v16.6,21.1
  Route 0.254: v16.6,21.1 16.6,20.5 17.2,19.9 19.8,19.9 20.6,20.7 25.7,20.7 26.9,19.5 32.3,19.5 v32.5,19.7
  Bottom 0.254: LED_5.3 31.6,7.91 31.6,7.9 31,8.5 31,9 33.1,11.1 33.1,11.7 31.6,13.2 31.6,14 31.79,14.19 LED_13.3 31.6,14.41 31.7,14.51 31.7,15.4 32.5,16.2 v32.5,19.7 32.5,19.89 31.79,20.59 LED_21.3 31.6,20.91 31.6,27 31.79,27.19 LED_29.3 31.6,27.41 31.6,33.6 31.72,33.72 LED_37.3 31.6,33.91 31.6,40 31.79,40.19 LED_45.3 31.6,40.41 31.6,46.6 31.72,46.72 LED_53.3 33.02,46.72 33.8,47.5 33.8,49 33.1,49.7 33.1,50.8 31.6,52.3 31.6,53 31.79,53.19 LED_61.3
BCOL5  (via drill 0.3)
  Top 0.254: U2.18 15.52,20.32 v15.8,20.6
  Route 0.254: v38.2,19.2 38,19 26.7,19 25.5,20.2 20.9,20.2 20.1,19.4 17,19.4 v15.8,20.6
  Bottom 0.254: LED_62.3 38.29,53.09 38.2,53 38.2,46.81 LED_54.3 38.29,46.49 38.2,46.4 38.2,40.31 LED_46.3 38.29,40.09 38.2,40 38.2,33.81 LED_38.3 38.29,33.69 38.2,33.6 38.2,27.31 LED_30.3 38.29,27.09 38.2,27 38.2,20.81 LED_22.3 38.29,20.49 38.2,20.4 v38.2,19.2 38.2,14.31 LED_14.3 38.29,10.29 37.4,9.4 37.4,8.5 38.09,7.81 38.2,7.81 LED_6.3
BCOL6  (via drill 0.3)
  Top 0.254: U2.19 16.32,19.68 16.8,19.2 v16.8,18.2
  Route 0.254: v16.8,18.2 17,18.4 23.4,18.4 24.1,17.7 24.8,17.7 25.6,18.5 v44.6,18.5
  Bottom 0.254: LED_7.3 44.6,7.91 44.6,14 44.79,14.19 LED_15.3 44.6,14.41 v44.6,18.5 44.6,20.4 44.79,20.59 LED_23.3 44.6,20.91 44.6,25.6 44.7,25.7 44.7,27.1 44.79,27.19 LED_31.3 44.6,27.41 44.6,28.5 43.7,29.4 43.7,30.1 44.6,31 44.6,33.6 44.72,33.72 LED_39.3 44.6,33.91 44.6,40.2 44.62,40.22 LED_47.3 44.6,40.41 44.6,46.4 44.79,46.59 LED_55.3 44.6,46.91 44.6,53 44.79,53.19 LED_63.3
BCOL7  (via drill 0.3)
  Top 0.254: U2.20 14.95,19.05 15.9,18.1 v15.9,18
  Route 0.254: v15.9,18 15.9,17.9 16.3,17.5 17.1,17.5 17.5,17.9 23.2,17.9 23.9,17.2 25,17.2 25.4,17.6 26.4,17.6 27.1,16.9 32.4,16.9 33.5,18 37.9,18 38.1,17.8 51,17.8 v51.2,18
  Bottom 0.254: LED_64.3 51.29,53.09 51.2,53 51.2,46.81 LED_56.3 51.29,46.49 51.2,46.4 51.2,40.31 LED_48.3 51.29,40.09 51.2,40 51.2,33.81 LED_40.3 51.29,33.49 51.2,33.4 51.2,27.31 LED_32.3 51.29,27.09 51.2,27 51.2,20.81 LED_24.3 51.29,20.49 51.2,20.4 v51.2,18 50.4,17.2 50.4,15.1 51.2,14.3 51.2,14.31 LED_16.3 51.22,14.22 51.2,14.2 51.2,7.81 LED_8.3
BOOST_5V
  pour Top (no thermals): 11.7,9.2 9.2,9.2 9.2,10.8 7.5,10.8 7.5,8.7 9.1,7.1 10.1,7.1 10.1,6 11.7,6
BUTTON  (via drill 0.3)
  Top 0.254: v43.1,32.2 44.14,31.16 U6.IO4 44.17,31.13 45,30.3 45,30 45.6,29.4 46,29.4 | R28.1 46,29.4 | TP25.TP 46,29.4
  Top 0.406: SW2.1 v50.71,54.11 | 51.71,53.11 v50.71,54.11 | v50.71,54.11 SW2.2
  Route 0.254: v43.1,53.8 50.4,53.8 v50.71,54.11
  Bottom 0.254: v43.1,53.8 v43.1,32.2 43.1,32.1
CHARGE  (via drill 0.3)
  Top 0.254: D1.A 51,30.65 50.8,30.45 50.8,29.7 v50.5,29.4 | v10,11.1 10.23,11.34 U7.6
  Route 0.254: v10,3.5 11,3.5 11.6,2.9 22.7,2.9 24.2,4.4 42.35,4.4 42.7,4.75 44.15,4.75 v44.35,4.55 | v50.5,29.4 49.4,29.4 48.1,28.1 v42.9,28.1
  Bottom 0.254: v10,11.1 v10,3.5 | v42.9,28.1 42.7,27.9 42.7,6.2 v44.35,4.55
DISCHARGE  (via drill 0.3)
  Top 0.254: U7.5 v10.01,12.61 v10,12.6 | D4.A 53.45,31.05 v52,32.5
  Route 0.254: v10.7,2.6 10.9,2.4 22.9,2.4 24.4,3.9 43.45,3.9 v43.6,4.05 | v52,32.5 50.5,32.5 49.4,31.4 42.4,31.4 v42.1,31.7
  Bottom 0.254: v10,12.6 10.7,11.9 v10.7,2.6 | v42.1,31.7 42.1,26.5 42.2,26.4 42.2,5.45 v43.6,4.05
ESP_ENABLE
  Top 0.254: U6.EN 37.82,52.3 37.3,52.3 37,52 R26.1
ESP_GPIO0  (via drill 0.3)
  Top 0.254: R23.1 32.5,51.1 32.8,50.8 32.8,49.8 32.3,49.3 30.8,49.3 TP15.TP 29.8,47.59 31.2,46.2 | U1.21 32.6,13.95 32.6,15.6 v30.4,17.8 | v30.2,45.24 31.15,46.2 31.2,46.2 | U6.IO0 31.2,46.2
  Bottom 0.254: v30.4,17.8 30.4,18.5 29.7,19.2 29.7,40.1 30.6,41 30.6,44.85 v30.21,45.24 v30.2,45.24
ESP_GPIO15
  Top 0.254: U6.IO15 34.1,47.54 34.1,50.7 34.9,51.5 R25.2
ESP_GPIO16
  Top 0.61: U$9.1 53.12,37 U6.IO18
ESP_RESET  (via drill 0.3)
  Top 0.254: v31.8,17.8 31.8,17.1 33.1,15.8 33.1,13.75 U1.20 | U6.RST 50.5,35.38 v50.5,34.98 50.5,32.5 49.4,31.4 48,31.4 47.7,31.1 R27.1 46.05,30.55 TP17.TP
  Route 0.254: v50.5,34.98 50.5,35 v30.9,35
  Bottom 0.254: v31.8,17.8 31.8,18.7 30.7,19.8 30.7,34.8 v30.9,35
ESP_TOUT
  Top 0.254: U6.TOUT 51.3,36.7
EXP_GPIO5  (via drill 0.3)
  Top 0.254: U6.IO5 49.46,34.3 v49.8,34.3
  Top 0.61: v52.7,33.6 53.4,33.6 U$6.1
  Route 0.254: v49.8,34.3 52,34.3 v52.7,33.6
GCOL0  (via drill 0.3)
  Top 0.254: U4.5 9.45,19.05 v8.4,18
  Bottom 0.254: LED_57.4 8.4,50.6 8.4,47 7.6,46.2 7.6,44.91 LED_49.4 7.71,44.69 8.4,44 8.4,40.4 7.6,39.6 7.6,38.41 LED_41.4 8.5,37.5 8.5,36.3 7.8,35.6 7.8,34.4 7.6,34.2 7.6,31.91 LED_33.4 9.2,31.8 9.7,31.3 9.7,30.4 8,28.7 8,28 7.6,27.6 7.6,25.41 LED_25.4 | LED_25.4 | LED_9.4 7.6,12.41 7.6,13.5 8.6,14.5 8.6,17.8 v8.4,18 8.4,18.11 LED_17.4 7.6,18.91 7.6,20.2 7.9,20.5 7.9,25 7.71,25.19 LED_25.4 | LED_9.4 | LED_1.4 7.6,5.91 7.6,7.2 8.4,8 8.4,9.6 7.71,10.29 LED_9.4
GCOL1  (via drill 0.3)
  Top 0.254: U4.6 12.38,19.68 12.8,20.1 v13.2,20.1
  Bottom 0.254: LED_58.4 14.21,51.19 14.8,50.6 14.8,47 14,46.2 14,45.01 LED_50.4 14.21,44.59 14.8,44 14.8,40.6 14,39.8 14,38.51 LED_42.4 14.21,38.19 14.8,37.6 14.8,34 14,33.2 14,32.01 LED_34.4 14.8,31.2 14.8,27.6 14,26.8 14,25.51 LED_26.4 14.3,25.3 14.8,24.8 14.8,21.8 14,21 14,20.1 | 14,20.1 14,19.01 LED_18.4 14.21,15.49 14.3,15.4 14.3,14.9 14.21,14.81 LED_10.4 14.3,12.3 15.3,11.3 15.3,8.2 14,6.9 14,6.01 LED_2.4 | v13.2,20.1 14,20.1
GCOL2  (via drill 0.3)
  Top 0.254: U4.7 10.92,20.32 v10.6,20
  Route 0.254: v11.9,3.6 13.4,5.1 19.5,5.1 v20,4.6
  Bottom 0.254: LED_59.4 21.4,50.6 21.4,47 20.6,46.2 20.6,44.91 LED_51.4 20.8,44.8 21.4,44.2 21.4,40.6 20.6,39.8 20.6,38.41 LED_43.4 21.4,37.6 21.4,34 20.4,33 20.4,32.11 LED_35.4 20.8,31.8 21.4,31.2 21.4,27.6 20.6,26.8 20.6,25.41 LED_27.4 21.4,24.6 21.4,21 20.6,20.2 20.6,18.91 LED_19.4 20.71,18.69 20.8,18.6 20.8,14.8 20.7,14.7 LED_11.4 | 20.6,12.41 LED_11.4 | LED_11.4 20.3,11.9 20.3,9.4 20.9,8.8 20.9,7.2 20.6,6.9 20.6,5.91 LED_3.4 20,5.09 v20,4.6 | v11.9,3.6 11.2,4.3 11.2,14.6 11.5,14.9 11.5,19.1 v10.6,20
GCOL3  (via drill 0.3)
  Top 0.254: v10.4,20.9 10.45,20.95 U4.8
  Route 0.254: v10.4,20.9 10.5,20.8 14.1,20.8 15.1,21.8 17.3,21.8 18.1,21 19.4,21 20.1,21.7 26.8,21.7 v27.7,20.8
  Bottom 0.254: LED_60.4 27.21,51.19 27.2,51.2 26.6,50.6 26.6,48.7 27.3,48 27.3,46.2 27,45.9 27,45.01 | 27,45 27,45.01 | 27,45.01 LED_52.4 27.8,44.2 27.8,40.6 27,39.8 27,38.51 LED_44.4 27.21,38.19 27.8,37.6 27.8,34 27,33.2 27,32.01 LED_36.4 27.7,31.3 27.7,27.5 27,26.8 27,25.51 LED_28.4 27.21,25.19 27.8,24.6 27.8,20.9 v27.7,20.8 27.7,20.5 27.2,20 LED_20.4 28.1,17.9 28.1,14.5 27,13.4 27,12.51 LED_12.4 27.21,12.01 26.8,11.6 26.8,9.3 27.3,8.8 27.3,7.5 27.2,7.4 LED_4.4
GCOL4  (via drill 0.3)
  Top 0.254: U4.9 9.91,21.59 v9.9,21.6
  Route 0.254: v9.9,21.6 11.9,21.6 12.2,21.3 13.9,21.3 14.9,22.3 17.5,22.3 18.3,21.5 19.2,21.5 19.9,22.2 33,22.2 v33.9,21.3 | v34.5,14.8 v36.6,14.8
  Bottom 0.254: 33.6,5.91 LED_5.4 | LED_61.4 33.7,49.8 34.4,49.1 34.4,47.2 33.4,46.2 33.4,45.11 LED_53.4 33.71,44.69 34.4,44 34.4,40.6 33.4,39.6 33.4,38.61 LED_45.4 34.4,37.6 34.4,34.2 33.4,33.2 33.4,32.11 LED_37.4 33.71,31.69 34.4,31 34.4,27.6 33.4,26.6 33.4,25.61 LED_29.4 34.2,24.8 34.2,21.6 v33.9,21.3 33.4,20.8 33.4,19.11 LED_21.4 33.71,18.69 34.5,17.9 v34.5,14.8 33.6,13.9 33.6,12.41 LED_13.4 | v36.6,14.8 36.6,10.7 35.6,9.7 35.6,7.1 35.9,6.8 35.9,6.6 35.15,5.85 34.9,5.85 34.85,5.8 LED_5.4 | LED_5.4
GCOL5  (via drill 0.3)
  Top 0.254: U4.10 10.48,22.22 v10.4,22.3
  Route 0.254: v10.4,22.3 12.1,22.3 12.6,21.8 13.7,21.8 14.8,22.9 19.3,22.9 19.5,22.7 39.9,22.7 v40.6,22
  Bottom 0.254: LED_6.4 40,6.01 40,6.9 40.9,7.8 40.9,8.4 40.6,8.7 40.6,12 40.3,12.3 LED_14.4 40,12.51 40,13.8 40.8,14.6 40.8,18.2 LED_22.4 40,19.01 40,20.2 40.8,21 40.8,22 | 40.8,22 40.8,24.6 40.21,25.19 LED_30.4 40,25.51 40,26.8 40.8,27.6 40.8,31.2 LED_38.4 40,32.01 40,33.2 40.8,34 40.8,37.8 40.3,38.3 LED_46.4 40,38.51 40,39.6 40.8,40.4 40.8,44.2 LED_54.4 40,45.01 40,46.2 40.8,47 40.8,50.6 40.21,51.19 LED_62.4 | v40.6,22 40.8,22
GCOL6  (via drill 0.3)
  Top 0.254: U4.11 10.84,22.86 10.7,23 v9.9,23
  Route 0.254: v9.9,23 12.1,23 12.8,22.3 13.5,22.3 14.6,23.4 19.5,23.4 19.7,23.2 46,23.2 v47.2,22
  Bottom 0.254: LED_7.4 46.4,6.11 46.4,7.2 47.2,8 47.2,11.8 LED_15.4 46.6,12.41 46.6,13.8 47.2,14.4 47.2,18.2 46.71,18.69 LED_23.4 46.4,19.11 46.4,20.2 47.2,21 v47.2,22 47.2,24.8 LED_31.4 46.4,25.61 46.4,26.8 47.4,27.8 47.4,31 46.71,31.69 LED_39.4 46.4,32.11 46.4,33.2 47.4,34.2 47.4,37.6 LED_47.4 46.4,38.61 46.4,39.8 47.4,40.8 47.4,44.2 46.8,44.8 LED_55.4 46.4,45.11 46.4,46.2 47.4,47.2 47.4,50.6 LED_63.4
GCOL7  (via drill 0.3)
  Top 0.254: U4.12 10.61,23.49 v10.4,23.7
  Route 0.254: v10.4,23.7 13.45,23.7 13.5,23.65 14.15,23.65 14.4,23.9 19.7,23.9 19.9,23.7 47.9,23.7 v48.6,23 | v48.6,18.5 48.8,18.7 v51.9,18.7
  Bottom 0.254: LED_8.4 53,6.01 53,7.2 53.6,7.8 53.6,12 53.3,12.3 LED_16.4 53,12.51 53,14.6 53.3,14.9 53.3,15.3 51.9,16.7 v51.9,18.7 53.11,18.7 LED_24.4 53,19.01 53,20.2 53.8,21 53.8,24.8 53.3,25.3 LED_32.4 53,25.51 53,26.4 53.3,26.7 53.3,31.7 LED_40.4 53,32.01 53,32.9 53.5,33.4 53.5,34.7 53.2,35 LED_48.4 53,38.51 53,39.8 53.8,40.6 53.8,44.2 LED_56.4 53,45.01 53,46.2 53.8,47 53.8,50.6 53.21,51.19 LED_64.4 | v48.6,23 48.7,22.9 48.7,18.6 v48.6,18.5
GND  (via drill 0.3)
  Top 0.203: U8.P$6 27.5,46.07 27.5,45.6 | U8.P$7 28,46.13 28,45.6 | U8.P$9 28.62,46.65 v29.3,46.65
  Top 0.254: U3.5 17.35,29.25 v17.4,29.3 | Q1.P$2 35.9,9.7 v35.9,11.1 | Q1.P$4 37.55,8.35 38.05,8.35 38.5,8.8 v38.5,9.4 | v26.1,45.8 26.3,45.6 27.5,45.6 28,45.6 | U1.8 29.88,7.6 v30.3,7.6 | U3.8 16.3,31.22 v16.3,31.9
  Top 0.406: R15.1 v4.6,37.4 4.6,36.6 4.9,36.3 R13.1 | R16.1 v4.6,38.5 4.6,39.2 5,39.6 R14.1 | J1.PIN$5 53.5,24.5 | R5.1 v4.6,32.9 | SW2.4 58.35,52.85 52.85,58.35 SW2.3 SW2.5 50.5,56.02 v50.5,55.95 | U6.GND$1 31.13,44.17 31.9,43.4 32.7,43.4 v32.9,43.6 | U6.GND$2 51.14,41.1 v50.2,41.1 | U6.GND$3 48.14,33.5 v48.8,33.5 | 11.51,16.51 11.5,16.5 | 12.9,26.7 v13.3,26.7 | R9.1 11.4,14.7 11.5,14.8 11.5,15.7 | C15.2 C13.2 | 23.35,51.45 v22.9,51.9 | U2.1 19.7,15.8 19.8,15.7 | 11.51,16.51 11.5,16.51 11.5,15.9 | 11.51,16.51 U4.1 | C7.2 6,15.5 | v27.7,50.25 26.85,50.25 C16.2
  Top 0.61: U5.2 v22.9,53.8 22.8,53.7 22.8,53 22.55,52.75 | C6.2 28.4,50.7 28.3,50.6 v28.3,50.25
  GND 0.254: v29.2,43.5 29.5,43.5
  GND 0.406: v4.6,32.9 4.6,31.4 | v50.2,41.1 50.3,41.1 | v48.8,33.5 48.7,33.4 | 4.9,10.2 4.9,10.8 | v4.6,38.5 4.6,38.8 | v5.85,15.75 6,15.9 | 16.3,7.8 16.3,7.7 16.2,7.6
  GND 0.61: 29,50.3 29.1,50.4
  Bottom 0.254: v50.5,55.95 50,55.45 50,53.1 50.2,52.9 v50.2,41.1
  other vias: 9.8,51.1 6.7,52 9.7,49.9 7.3,52.7 52.1,26.1 52,24.5 50,28.7 50.5,28.1 22.25,3.9 34.6,53.9 10.5,50.4 4.8,54.2 4.8,55.3 5.8,55.3 8,53.3 10.3,16.25 10.8,15.85 13.2,10 14.6,10 13.9,10.9 13.9,10 14.6,10.9 14.3,3.6 14.3,8.2 14.3,4.4 10,1 15,1 20,1 25,1 30,1 40,1 45,1 50,1 54,1 59,6 59,10 59,15 25,59 20,59 15,59 10,59 5,59 1.1,58.9 1,55 1,50 1,45 1,40 1,35 1,30 1,25 1,20 1,15 18,13.6 24.65,9.25 58.9,1.1 1.1,1.1 17.3,13.64 22.55,15.95 22.5,15.3 6.8,26.4 13.2,10.9 12.5,10.9 12.5,10 50.4,26.3 52,25.3 58.7,18.3 55.7,18.3 55,27.7 17.2,37.8 23.6,44.8 32.7,37.4 36.2,44.6 49.2,40 36,31.9 26.1,26.2 37.3,15.7 39.1,11.8 45.5,11.2 32.6,26.2 40.05,8 37,5.6 41.45,5.6 45.7,6.9 51.2,4.1 18.75,15.7 10.6,17.95 17.6,10
  pour GND: 0,60 33.1,60 60,33.1 60,27.7 54.8,27.7 54.8,18.7 60,18.7 60,0 0,0
  pour Top (no thermals): 54,24.1 54,26.1 50.1,26.1 50.1,24.4 51.9,24.4 51.9,24.1
  pour Top (no thermals): 17.9,10.4 17.9,9.7 15.3,9.7 15.3,7.7 16.1,7.7 16.1,6.1 14.3,6.1 14.3,3.7 12.3,3.7 12.3,9.7 9.7,9.7 9.7,10.4 12.3,10.4 12.3,12.8 15.3,12.8 15.3,10.4
  pour Top (no thermals): 23.6,13.5 23.6,15.4 20.3,15.4 19.8,15.9 17.9,15.9 17.6,15.6 17.6,13.5
  pour Bottom: 0,0 60,0 60,27.1 53.2,27.1 53.2,39.9 39.1,54 33,54 32.4,54.1 32.4,60 0,60
  pour Top: 0,11.4 0,60 32.4,60 32.4,54.1 39,54.1 53.2,39.9 53.2,27.1 60,27.1 60,5 59,5 50,14 46,10 48.4,7.6 47.3,6.5 49.5,4.3 50.5,5.3 55,1 55,0 7.5,0 7.5,1 10.2,3.7 12.3,3.7 12.3,4.5 24,4.7 24,12.2 15.3,12.2 15.3,10.3 12.3,10.3 12.3,12.9 3.7,12.9 3.7,11.4
  pour Top (no thermals): 52.4,20.3 52.4,22.3 50.3,22.3 50.3,20.3
I2C_SCL  (via drill 0.3)
  Top 0.203: U8.P$2 26.17,49.1 25.45,49.1 v25.2,49.35
  Top 0.254: U6.IO14 36.9,51.1 36.1,51.1 v35.9,50.9 | R18.1 v31.3,50.9 31.3,50.8 TP6.TP
  Route 0.254: v35.9,50.9 35.4,51.4 34.6,51.4 34.2,51 31.3,51 | v25.2,49.35 26.85,51 31.3,51 | 31.3,51 v31.3,50.9
I2C_SDA  (via drill 0.3)
  Top 0.203: U8.P$10 28.73,47.1 28.8,47.1 29,47.3
  Top 0.254: 29,47.3 29.1,47.4 29.1,47.6 28.8,47.9 28.8,48.7 29.2,49.1 29.2,49.7 TP5.TP | TP5.TP 30.25,50.3 v30.35,50.2 | TP5.TP 30.1,50.6 R17.1 | U6.IO12 35.68,50.2 35.45,50.2 v35,50.65
  Route 0.254: v35,50.65 34.6,50.65 34.15,50.2 v30.35,50.2
LED_CLK  (via drill 0.3)
  Top 0.254: U1.26 27.7,15.47 TP2.TP 26.3,17.6 25.4,17.6 25,17.2 21,17.2 20.42,17.78 U2.3 18.53,17.78 17.1,16.35 v17.1,15.75 | v12.77,17.57 12.57,17.78 U4.3
  Route 0.254: v17.1,15.75 16.85,15.5 15,15.5 12.93,17.57 v12.77,17.57
LED_DAT_0
  Top 0.254: U2.2 20.36,17.14 20.8,16.7 23.2,16.7 TP1.TP 24.3,16.2 25.3,15.2 26.1,15.2 26.4,14.9 27.56,14.9 U1.27
LED_DAT_1
  Top 0.254: U2.22 13.63,17.78 13.43,17.58 13.43,17.28 13,16.85 12.55,16.85 12.26,17.14 U4.2
LED_HS_EN  (via drill 0.3)
  Top 0.254: U1.22 32.1,14.16 32.1,15.2 30.1,17.2 29.95,17.2 v29.4,17.75 | TP22.TP 17.9,31.5 v17.5,31.1 17.5,30.3 17.1,29.9 U3.6 15.3,29.9 15.1,29.7 R21.2
  Route 0.254: v29,30.9 17.7,30.9 v17.5,31.1
  Bottom 0.254: v29.4,17.75 29.2,17.95 29.2,30.7 v29,30.9
LED_OE  (via drill 0.3)
  Top 0.254: v34.5,11.55 34.05,11.55 33.4,10.9 U1.16 | v7.4,17.7 7.4,17.9 6.9,18.4 6.31,18.4 U4.21 6.29,18.4 5.5,18.4 5.1,18 5.1,14 5.6,13.5 R6.1 | v15.85,16.95 15.2,17.6 15.2,18.1 14.89,18.41 U2.21 13.74,18.41 13.25,18.9 13.25,19.1 v13.1,19.25 | U3.4 17,28.6 17.1,28.5 v17.9,28.5 | TP4.TP 25.7,16.7 v25.9,16.9
  Route 0.254: v35.8,17.3 33.5,17.3 32.6,16.4 26.8,16.4 26.3,16.9 v25.9,16.9 25.4,16.9 25.2,16.7 23.7,16.7 23,17.4 17.8,17.4 17.3,16.9 15.9,16.9 v15.85,16.95 | v13.1,19.25 8.65,19.25 7.4,18 v7.4,17.7 | v35.9,12 34.95,12 v34.5,11.55 | v17.9,28.5 18.5,29.1 v36,29.1
  Bottom 0.254: v35.9,12 35.8,12.1 v35.8,17.3 36,17.5 v36,29.1
LED_ROW_A  (via drill 0.3)
  Top 0.254: U3.1 23.95,26.65 v24.2,26.9 25,27.7 25,30.5 TP19.TP | U1.30 27.04,13.3 26.1,13.3 26,13.2 25.2,13.2 24.6,13.8 24.6,14.95 v24.5,15.05
  Bottom 0.254: v24.2,26.9 23.8,26.5 23.8,20.3 24.8,19.3 24.8,18.9 25.1,18.6 25.1,18 24.6,17.5 24.6,15.05 v24.5,15.05
LED_ROW_B  (via drill 0.3)
  Top 0.254: U1.31 26.83,12.8 26.3,12.8 26,12.5 24.9,12.5 v24.45,12.05 | U3.2 23.1,27.3 v23.5,27.7 24,28.2 TP20.TP
  Bottom 0.254: v23.5,27.7 23.3,27.5 23.3,19.5 23.1,19.3 23.1,18.7 23.25,18.55 23.25,15.05 23.1,14.9 23.1,14.15 23.35,13.9 23.35,12.85 24.15,12.05 v24.45,12.05
LED_ROW_C  (via drill 0.3)
  Top 0.254: U1.32 26.62,12.3 26.5,12.3 26,11.8 v25.4,11.8 | U3.3 17.05,27.95 17.2,27.8 22.3,27.8 v22.8,28.3 22,29.1 TP21.TP
  Bottom 0.254: v22.8,28.3 22.8,19.7 22.5,19.4 22.5,18.6 21.8,17.9 21.8,14.4 22.8,13.4 22.8,12.75 24.25,11.3 24.7,11.3 25.2,11.8 v25.4,11.8
LED_S0
  Top 0.254: U3.15 9.8,27.3 9.7,27.2 9.1,27.2 8.3,28 U10.2
LED_S1  (via drill 0.3)
  Top 0.254: v5.1,28.1 5.2,28 U10.5 | v11.6,28 11.55,27.95 U3.14
  Route 0.254: v11.6,28 11,28.6 5.6,28.6 v5.1,28.1
LED_S2
  Top 0.254: U9.2 8.25,30.8 9.1,29.95 9.1,29.1 9.6,28.6 U3.13
LED_S3  (via drill 0.3)
  Top 0.254: U3.12 11.35,29.25 v11.6,29 | v4.9,30.7 5,30.8 U9.5
  Route 0.254: v11.6,29 11.5,29.1 8.3,29.1 6.7,30.7 v4.9,30.7
LED_S4
  Top 0.254: U3.11 9.9,29.9 9.6,30.2 9.6,31.6 8.9,32.3 U11.2
LED_S5  (via drill 0.3)
  Top 0.254: U11.5 8.9,35.5 9.2,35.8 v9.6,35.8 | v11.8,31.1 11.25,30.55 U3.10
  Bottom 0.254: v11.8,31.1 11.25,31.1 9.7,32.65 9.7,35.7 v9.6,35.8
LED_S6
  Top 0.254: U12.2 11.8,32.7 10.48,31.38 U3.9
LED_S7
  Top 0.254: U12.5 11.8,35.4 12,35.6 12.8,35.6 14.9,33.5 14.9,31.1 15.45,30.55 U3.7
LED_STB  (via drill 0.3)
  Top 0.254: v27.4,17.6 26.8,18.2 25.3,18.2 24.8,17.7 21.2,17.7 20.49,18.41 U2.4 18.41,18.41 16.3,16.3 v16.3,16.2 | 11.71,18.4 U4.4 12.71,18.41 v12.75,18.45 | U1.29 27.4,13.65 v26.85,14.2 TP3.TP
  Route 0.254: v16.3,16.2 15.5,16.2 13.25,18.45 v12.75,18.45
  Bottom 0.254: v27.4,17.6 27.4,14.75 v26.85,14.2
N$1
  Top 0.254: D4.C 53.45,28.45 53.1,28.1 SJ1.2 51.55,28.36 D1.C
N$2
  Top 0.254: U4.23 6.96,17.14 7.2,16.9 7.2,16.6 7.5,16.3 8.1,16.3 8.9,15.5 R9.2
N$3
  pour Top (no thermals): 15.8,9.2 17.9,9.2 17.9,7.5 18.4,7.5 18.4,7.8 23.4,7.8 23.4,5.5 18.6,5.5 18.6,6.1 16.7,6.1 16.7,8.3 15.8,8.3
N$5
  Top 0.203: U8.P$4 25.83,48.3 25.2,48.3 24.95,48.05
  Top 0.254: 24.95,48.05 24.2,48.05 23.85,48.4 23.85,50 24,50.15 C13.1
N$6
  Top 0.254: U1.17 33.88,12.4 34.8,12.4 35.2,12 35.2,10.7 34.7,10.2 34.7,8.4 34.95,8.15 Q1.P$3
N$7
  Top 0.813: C10.1 16.45,4.95 16.55,4.85 R10.2
N$9
  Top 0.254: J1.PIN$2 54.05,22.55 53.85,22.75 Z1.2 50.25,22.75 49,24 48.85,24.15 48.7,24.3 R7.1
N$10
  Top 0.254: J1.PIN$3 54.4,23.2 54,23.6 Z2.2 50.3,23.6 49.6,24.3 49.6,27.95 49.3,28.25 R8.1
N$15
  Top 0.406: U5.4 C16.1 | C16.1
N$18
  Top 0.254: U2.23 14.86,17.14 15.2,16.8 15.2,16.3 16,15.5 16.1,15.5 16.9,14.7 R1.2
N$61
  Top 0.254: U1.18 33.77,13 36,13 37.35,11.65 Q1.P$1
RCOL0  (via drill 0.3)
  Top 0.254: R19.5 23.4,18.6 23.6,18.4 v24.35,18.4
  Route 0.254: v23.8,14.5 23.6,14.3 16.9,14.3 16.8,14.2 13.9,14.2 13,15.1 10.3,15.1 v9.31,16.09 v9.3,16.09
  Bottom 0.254: LED_57.1 9,52 9,46.09 LED_49.1 8.7,45.7 9,45.4 9,39.59 LED_41.1 8.7,39.1 9,38.8 9,36.1 8.3,35.4 8.3,33.3 8.7,32.9 LED_33.1 8.86,32.79 10.25,31.4 10.25,30.25 8.5,28.5 8.5,27.8 8.1,27.4 8.1,26.89 LED_25.1 9,26 9,24.7 8.5,24.2 8.5,20.1 8.7,19.9 LED_17.1 9.1,19.39 9.1,16.09 | LED_1.1 9,7.09 9,9.7 8.2,10.5 8.2,11.4 9,12.2 9,13.2 8.7,13.2 LED_9.1 9.1,13.69 9.1,16.09 | v24.35,18.4 24,18.05 24,15.85 23.8,15.65 v23.8,14.5 | 9.1,16.09 v9.3,16.09
RCOL0_
  Top 0.254: U2.5 20.65,19.05 21.1,18.6 R19.4
RCOL1  (via drill 0.3)
  Top 0.254: R19.6 23.7,19.4 v23.9,19.2
  Route 0.254: v23.9,19.2 20.6,19.2 20.3,18.9 v16.1,18.9
  Bottom 0.254: LED_10.1 | 15.4,18.9 15.4,19.4 15.2,19.6 LED_18.1 15.1,19.9 15.1,21.2 15.4,21.5 15.4,26 15.2,26.2 LED_26.1 15.4,26.49 15.4,32.6 LED_34.1 15.4,32.99 15.4,39.2 15.31,39.29 LED_42.1 15.4,39.49 15.4,45.6 LED_50.1 15.4,45.99 15.4,52 15.2,52.2 LED_58.1 | 15.4,18.9 15.4,18.7 14.7,18 14.7,15.8 15.1,15.4 15.1,13.39 LED_10.1 | LED_10.1 | v16.1,18.9 15.4,18.9 | LED_10.1 15.8,12.7 15.8,7.39 LED_2.1
RCOL1_
  Top 0.254: U2.6 20.72,19.68 21,19.4 R19.3
RCOL2  (via drill 0.3)
  Top 0.254: R19.7 24.5,20.2 v25.5,19.2
  Route 0.254: v22.05,25.2 v24.5,25.2
  Bottom 0.254: LED_59.1 21.7,52.1 22,51.8 22,46.09 LED_51.1 21.7,45.7 22,45.4 22,39.59 LED_43.1 21.7,39.1 22,38.8 22,33.09 LED_35.1 21.7,32.7 22,32.4 22,26.59 LED_27.1 | LED_27.1 21.7,26.1 | LED_3.1 21.7,6.9 21.4,7.2 21.4,9 20.8,9.6 20.8,10.6 21.7,11.5 LED_11.1 21.3,13.69 21.3,18.1 22,18.8 22,19.4 21.7,19.7 LED_19.1 22.05,20.14 v22.05,25.2 22.05,25.94 LED_27.1 | v24.5,25.2 24.3,25 24.3,20.6 25.5,19.4 v25.5,19.2
RCOL2_
  Top 0.254: U2.7 20.98,20.32 21.1,20.2 R19.2
RCOL3  (via drill 0.3)
  Top 0.254: R19.8 23.4,21 23.9,21.5 28.3,21.5 v28.5,21.3
  Bottom 0.254: 28.4,21.3 28.4,26 28.2,26.2 LED_28.1 28.3,26.39 28.3,32.5 28.2,32.6 LED_36.1 28.4,32.99 28.4,39 28.2,39.2 LED_44.1 28.4,39.49 28.4,45.4 28.2,45.6 LED_52.1 27.8,46.2 27.8,48.2 27.4,48.6 27.4,49.1 27.85,49.55 28.65,49.55 29,49.9 29,51.49 LED_60.1 | 28.4,21.3 28.4,19.99 LED_20.1 28.2,19.6 28.6,19.2 28.6,13.69 LED_12.1 28.2,12.15 27.3,11.25 27.3,9.7 28.6,8.4 28.6,7.3 28.2,6.9 LED_4.1 | v28.5,21.3 28.4,21.3
RCOL3_
  Top 0.254: U2.8 21.53,20.95 R19.1
RCOL4  (via drill 0.3)
  Top 0.254: R20.5 34.8,22 v35,21.8
  Bottom 0.254: LED_5.1 35.1,7.19 35.1,9.9 35.2,10 35.2,12.6 34.7,13.1 LED_13.1 35,13.59 35,13.6 35.2,13.8 35.2,15.4 35,15.6 35,19.4 34.7,19.7 LED_21.1 35,20.09 v35,21.8 35,25.8 34.7,26.1 LED_29.1 35,26.59 35,32.4 34.7,32.7 LED_37.1 35,33.09 35,38.8 34.7,39.1 LED_45.1 35,39.59 35,45.2 34.7,45.5 LED_53.1 34.7,46.05 34.9,46.25 34.9,48.8 36.6,50.5 36.6,51.3 36.1,51.8 35.19,51.8 LED_61.1
RCOL4_
  Top 0.254: U2.9 20.69,21.59 21.1,22 R20.4
RCOL5  (via drill 0.3)
  Top 0.254: R20.6 41,22.8 v41.5,22.3
  Bottom 0.254: LED_62.1 41.2,52.2 41.4,52 41.4,45.99 LED_54.1 41.4,45.6 41.4,39.49 LED_46.1 41.2,39 41.4,38.8 41.4,32.99 LED_38.1 41.4,32.6 41.4,26.49 LED_30.1 41.2,26.2 41.4,26 41.4,22.3 | 41.4,22.3 41.4,19.99 LED_22.1 41.2,19.6 41.4,19.4 41.4,13.49 LED_14.1 41.2,13.2 41.4,13 41.4,6.99 LED_6.1 | v41.5,22.3 41.4,22.3
RCOL5_
  Top 0.254: U2.10 20.62,22.22 21.2,22.8 R20.3
RCOL6  (via drill 0.3)
  Top 0.254: R20.7 46.8,23.6 v47.9,22.5
  Bottom 0.254: LED_7.1 48,7.09 48,13 LED_15.1 47.9,13.49 47.9,19.7 47.81,19.79 LED_23.1 47.9,19.99 47.9,21.8 v47.9,22.5 47.9,26.1 LED_31.1 48,26.59 48,32.6 47.81,32.79 LED_39.1 48,33.09 48,39 LED_47.1 48,39.59 48,45.6 47.8,45.6 47.7,45.7 LED_55.1 48,46.09 48,52 LED_63.1
RCOL6_
  Top 0.254: U2.11 20.46,22.86 21.2,23.6 R20.2
RCOL7  (via drill 0.3)
  Top 0.254: R20.8 v37.3,24.4
  Route 0.254: v37.3,17.3 v52.6,17.3
  Bottom 0.254: LED_64.1 54.2,52.2 54.4,52 54.4,45.99 LED_56.1 54.4,45.6 54.4,39.49 LED_48.1 | LED_8.1 54.4,6.99 54.4,13.2 54.29,13.2 LED_16.1 54.2,15.1 52.6,16.7 v52.6,17.3 53.1,17.3 54.4,18.6 54.4,19.4 54.2,19.6 LED_24.1 54.4,19.99 54.4,26 54.2,26.2 LED_32.1 53.8,26.7 53.8,31 54.2,31.4 LED_40.1 | v37.3,24.4 v37.3,17.3 | 54.2,39.1 | 54.2,39.1 LED_48.1 | LED_48.1 | LED_48.1 54.2,38.1 53.8,37.7 53.8,35.5 54.2,35.1 LED_40.1 | LED_40.1
RCOL7_
  Top 0.254: U2.12 20.29,23.49 21.2,24.4 R20.1
USB_5V  (via drill 0.3)
  Top 0.406: 54.4,16.1 v54.5,16 | v54.5,16.7 v53.8,16.7 | J1.PIN$1 54,21.9 | 54,21.9 53.95,21.9 | Z3.2 53.65,21.55 54,21.9
  Top 0.813: D3.A 8.65,12.95 9.3,13.6 v13.3,13.6 | v13.3,12.9 v13.3,13.6 | R24.2 13.3,14.75 v13.3,13.6
  Top 1.016: v53.8,16.7 54.4,16.7 54.4,16.1 v53.8,16.7 | U7.4 17.6,12.6 v17.7,12.5 v19.1,12.5 20.23,12.5 C17.1 | v53.8,16.7 53.8,21.25 Z3.2
  other vias: 18.4,12.5
  pour Route: 55,12.5 55,17.5 53,17.5 51.5,16 38,16 37,15 25.5,15 24.5,14 13.5,14 13,14.5 11,14.5 11,12 15,12 15.5,11.5 24,11.5 25,12.5
USB_D+  (via drill 0.3)
  Top 0.254: U1.3 26.84,8.9 25.95,8.9 24.1,7.05 24.1,5.8 v24.15,5.75 | R8.2 47.25,28.25 46.5,27.5 43.8,27.5 v43.5,27.2
  Route 0.254: v43.4,7 43.1,7.3 32.3,7.3 30.7,5.7 25.3,5.7 25.1,5.9 24.3,5.9 v24.15,5.75
  Bottom 0.254: v43.5,27.2 43.3,27 43.3,7.1 v43.4,7
USB_D-  (via drill 0.3)
  Top 0.254: U1.4 27.05,8.4 26.1,8.4 24.6,6.9 24.6,6.25 24.85,6 24.85,5.15 v24.9,5.1 | R7.2 46.9,27.1 46.8,27 44.5,27 44,26.5 v44,26.2
  Route 0.254: v24.9,5.1 30.75,5.1 32.45,6.8 42.65,6.8 43.2,6.25 44.25,6.25 v44.5,6.5
  Bottom 0.254: v44.5,6.5 44.5,6.9 43.8,7.6 43.8,26 v44,26.2
VBAT  (via drill 0.3)
  other vias: 50.5,11.9 50.5,10.8 50.5,8.7 52.1,6.5 54.4,5.5 55.9,4
  pour Top (no thermals): 50,13 58.1,4.9 55.1,1.9 50.7,6.3 49.4,7.6 47,10
VBAT_FUSED  (via drill 0.3)
  Top 0.254: TP8.TP v38,3
  Top 1.016: C12.1 22.5,10.9 | D5.C 42.94,3 v44.3,3 v45.1,3 v45.9,3 46.6,3 L2.2
  Bottom 1.016: 21.65,10.05 v22.4,10.05 | v23.1,10.05 v22.4,10.05 | v22.4,10.05 22.4,7.8 23.1,7.1 23.1,4.8 v25.2,2.7 v26.6,2.7 v25.9,2.7
  other vias: 21.7,10.05
  pour Top (no thermals): 15.9,11.7 19.2,11.7 19.5,11.4 23.4,11.4 23.4,9.7 18.8,9.7 18.8,10.9 15.9,10.9
  pour Route: 47,4 24.5,4 24.5,1.5 47,1.5

## Text on the board
tPlace: - | +
Document: Silk layers: / 200: 2 sigma bottom (LED side) / 201: 2 sigma top (component side) / 203: HRC back (LED side) / 204: Labels top (component side) / 206: Blinkinlabs top (component side)
204bmp: EightByEight Blinky / 2017-02-12 RevH